# Altium project STM32_DSP.PrjPcb (part 1 of 2)
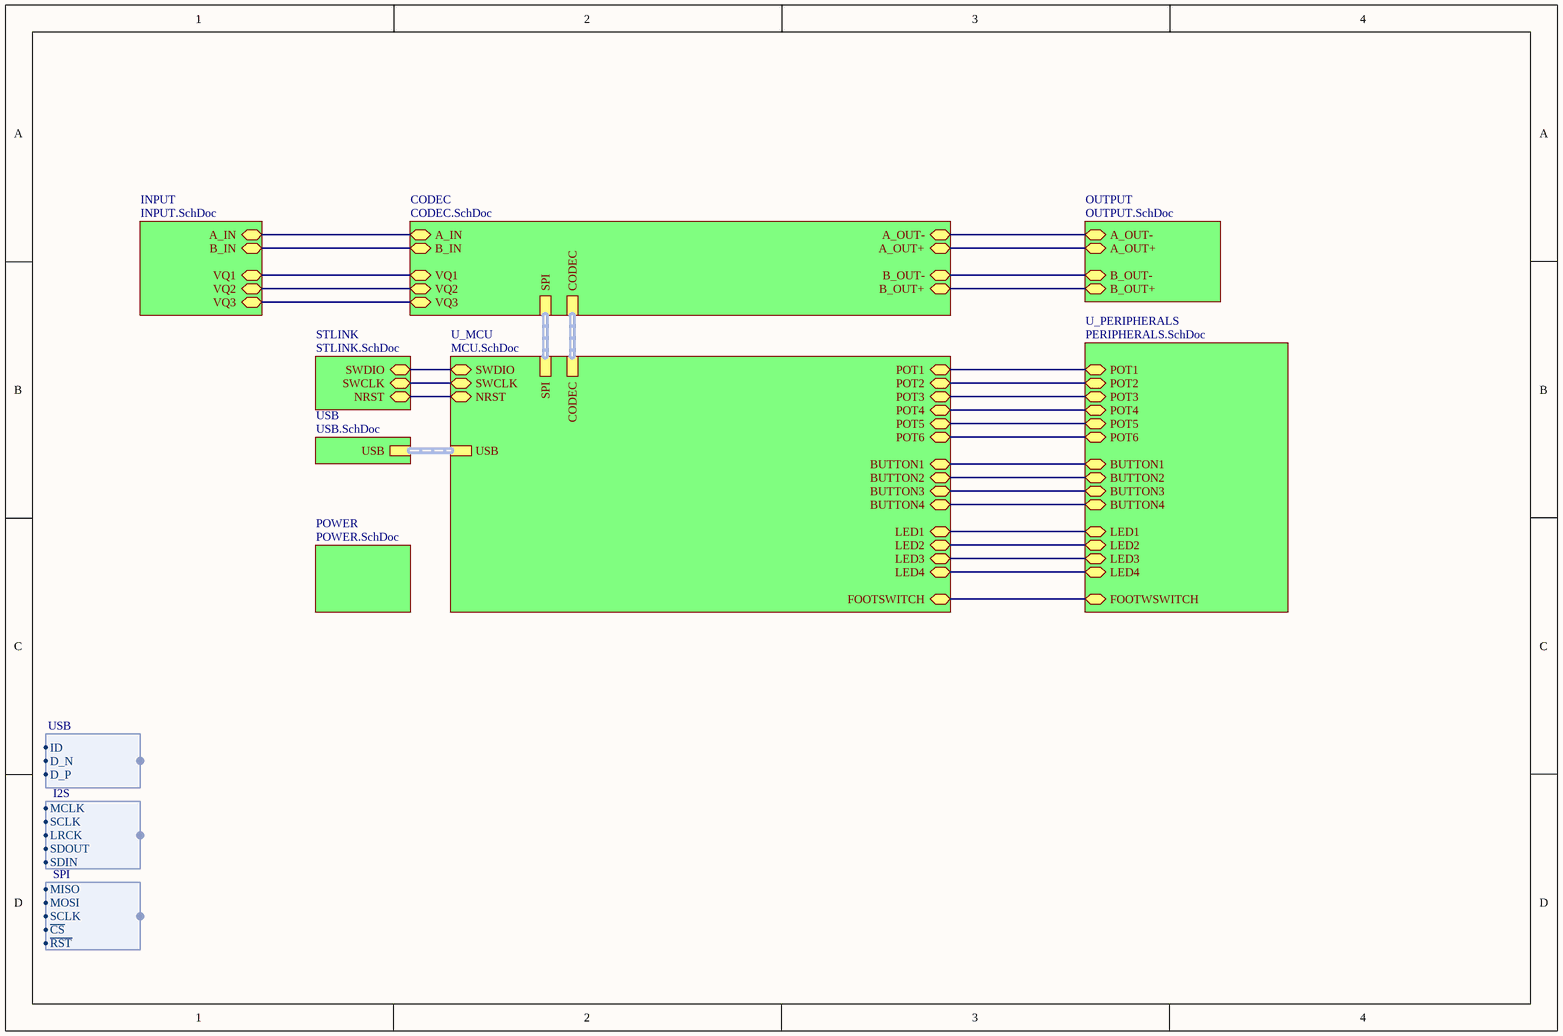
[diagram p0: TOP.SchDoc]
9 sheets, 281 parts. Net scope: hierarchical (ports join the sheet entries above them; power ports are global).
Board file: STM32_DSP.PcbDoc
Sheets:
  TOP.SchDoc
    INPUT = INPUT.SchDoc
    OUTPUT = OUTPUT.SchDoc
    CODEC = CODEC.SchDoc
    STLINK = STLINK.SchDoc
    U_MCU = MCU.SchDoc
    U_PERIPHERALS = PERIPHERALS.SchDoc
    USB = USB.SchDoc
    POWER = POWER.SchDoc

## Sheet TOP.SchDoc
size A4; SheetNumber: 1; SheetTotal: 9

### Sub-sheets
CODEC = CODEC.SchDoc: CODEC (harness I2S), A_OUT- (bidir), A_OUT+ (bidir), B_OUT- (bidir), B_OUT+ (bidir), SPI (harness SPI), A_IN (bidir), B_IN (bidir), VQ1 (bidir), VQ2 (bidir), VQ3 (bidir)
INPUT = INPUT.SchDoc: VQ2 (bidir), VQ1 (bidir), VQ3 (bidir), A_IN (bidir), B_IN (bidir)
OUTPUT = OUTPUT.SchDoc: A_OUT- (bidir), A_OUT+ (bidir), B_OUT- (bidir), B_OUT+ (bidir)
POWER = POWER.SchDoc: no entries
STLINK = STLINK.SchDoc: SWDIO (bidir), SWCLK (bidir), NRST (bidir)
U_MCU = MCU.SchDoc: NRST (bidir), SWDIO (bidir), SWCLK (bidir), CODEC (harness I2S), SPI (harness SPI), POT1 (bidir), POT2 (bidir), POT3 (bidir), POT4 (bidir), POT5 (bidir), POT6 (bidir), BUTTON1 (bidir), BUTTON2 (bidir), BUTTON3 (bidir), BUTTON4 (bidir), LED1 (bidir), LED2 (bidir), LED3 (bidir), LED4 (bidir), FOOTSWITCH (bidir), USB (harness USB)
U_PERIPHERALS = PERIPHERALS.SchDoc: POT4 (bidir), POT5 (bidir), POT6 (bidir), POT1 (bidir), POT2 (bidir), POT3 (bidir), LED3 (bidir), LED1 (bidir), LED4 (bidir), LED2 (bidir), BUTTON1 (bidir), BUTTON3 (bidir), BUTTON2 (bidir), BUTTON4 (bidir), FOOTWSWITCH (bidir)
USB = USB.SchDoc: USB (harness USB)

### Harnesses
USB: D_P, D_N, ID
I2S: MCLK, SCLK, LRCK, SDOUT, SDIN
SPI: MISO, MOSI, SCLK, ~{CS}, ~{RST}

### Nets
A_IN: sheet INPUT/A_IN, sheet CODEC/A_IN
A_OUT+: sheet OUTPUT/A_OUT+, sheet CODEC/A_OUT+
A_OUT-: sheet OUTPUT/A_OUT-, sheet CODEC/A_OUT-
B_IN: sheet INPUT/B_IN, sheet CODEC/B_IN
B_OUT+: sheet OUTPUT/B_OUT+, sheet CODEC/B_OUT+
B_OUT-: sheet OUTPUT/B_OUT-, sheet CODEC/B_OUT-
BUTTON1: sheet U_MCU/BUTTON1, sheet U_PERIPHERALS/BUTTON1
BUTTON2: sheet U_MCU/BUTTON2, sheet U_PERIPHERALS/BUTTON2
BUTTON3: sheet U_MCU/BUTTON3, sheet U_PERIPHERALS/BUTTON3
BUTTON4: sheet U_MCU/BUTTON4, sheet U_PERIPHERALS/BUTTON4
FOOTSWITCH: sheet U_MCU/FOOTSWITCH, sheet U_PERIPHERALS/FOOTWSWITCH
LED1: sheet U_MCU/LED1, sheet U_PERIPHERALS/LED1
LED2: sheet U_MCU/LED2, sheet U_PERIPHERALS/LED2
LED3: sheet U_MCU/LED3, sheet U_PERIPHERALS/LED3
LED4: sheet U_MCU/LED4, sheet U_PERIPHERALS/LED4
NRST: sheet STLINK/NRST, sheet U_MCU/NRST
POT1: sheet U_MCU/POT1, sheet U_PERIPHERALS/POT1
POT2: sheet U_MCU/POT2, sheet U_PERIPHERALS/POT2
POT3: sheet U_MCU/POT3, sheet U_PERIPHERALS/POT3
POT4: sheet U_MCU/POT4, sheet U_PERIPHERALS/POT4
POT5: sheet U_MCU/POT5, sheet U_PERIPHERALS/POT5
POT6: sheet U_MCU/POT6, sheet U_PERIPHERALS/POT6
SWCLK: sheet STLINK/SWCLK, sheet U_MCU/SWCLK
SWDIO: sheet STLINK/SWDIO, sheet U_MCU/SWDIO
VQ1: sheet INPUT/VQ1, sheet CODEC/VQ1
VQ2: sheet INPUT/VQ2, sheet INPUT/VQ3, sheet CODEC/VQ2, sheet CODEC/VQ3

### Buses and harness runs
harness sheet CODEC/CODEC = sheet U_MCU/CODEC
harness sheet CODEC/SPI = sheet U_MCU/SPI
harness sheet U_MCU/USB = sheet USB/USB

## Sheet INPUT.SchDoc
size A4; SheetNumber: 2; SheetTotal: 9
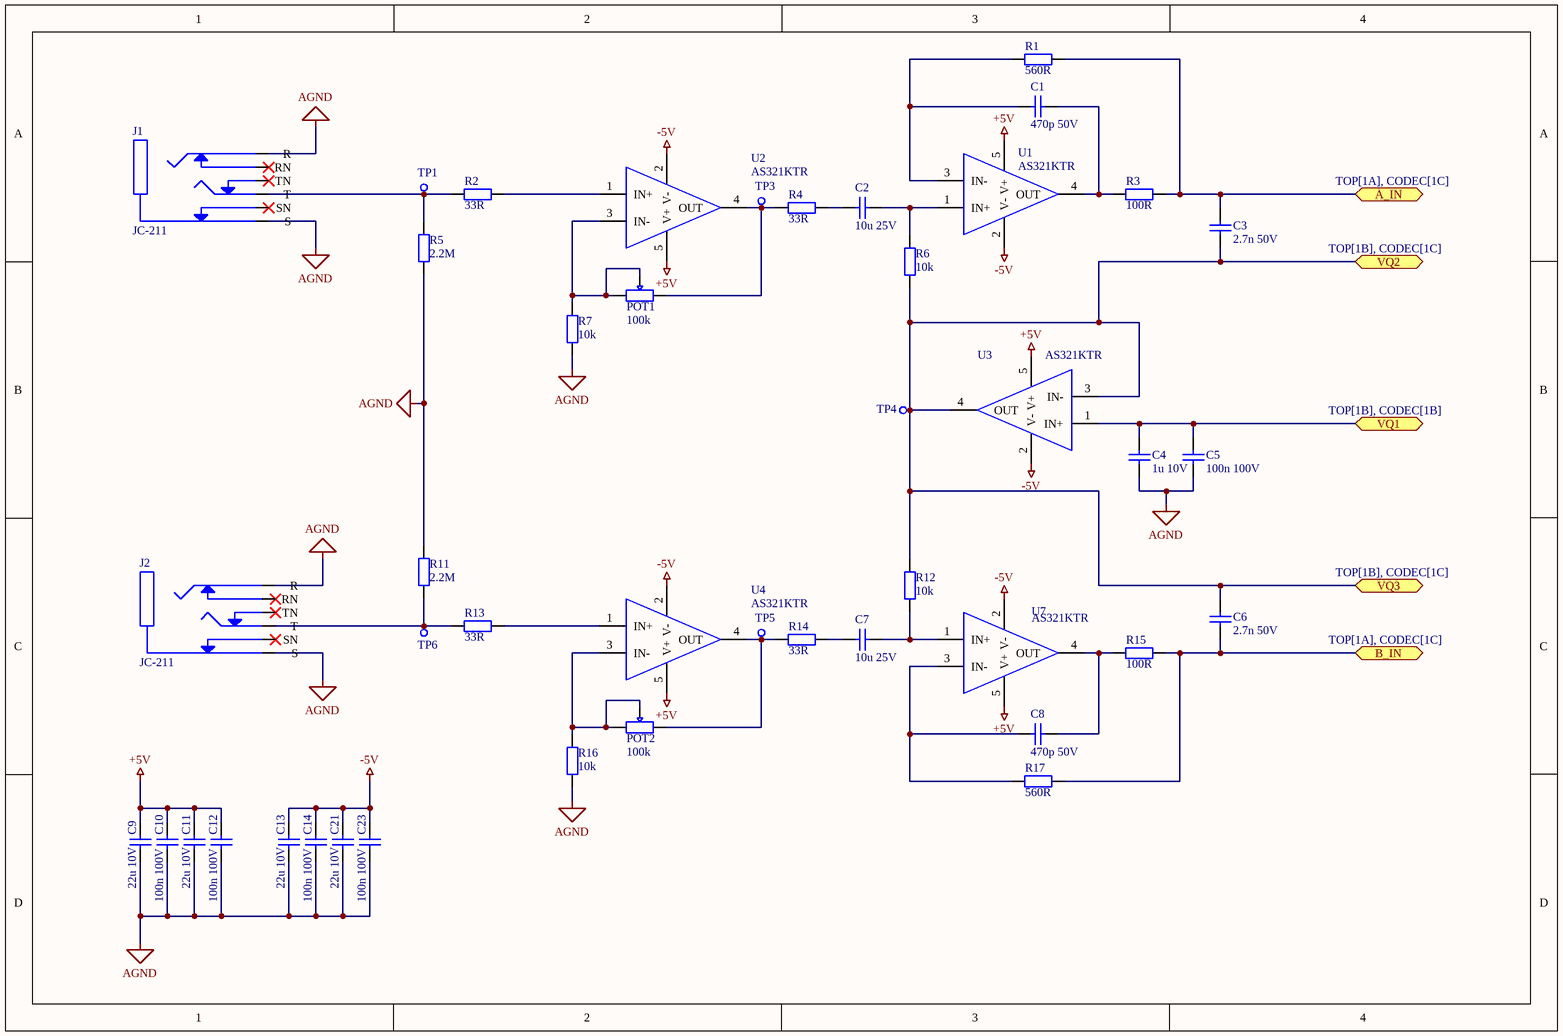
[diagram p1: INPUT.SchDoc]

### Parts
C1  470p 50V  [CAPACITOR 0805]
C2  10u 25V  [CAPACITOR 0805]
C3  2.7n 50V  [CAPACITOR 0805]
C4  1u 10V  [CAPACITOR 0805]
C5  100n 100V  [CAPACITOR 0805]
C6  2.7n 50V  [CAPACITOR 0805]
C7  10u 25V  [CAPACITOR 0805]
C8  470p 50V  [CAPACITOR 0805]
C9  22u 10V  [CAPACITOR 0805]
C10  100n 100V  [CAPACITOR 0805]
C11  22u 10V  [CAPACITOR 0805]
C12  100n 100V  [CAPACITOR 0805]
C13  22u 10V  [CAPACITOR 0805]
C14  100n 100V  [CAPACITOR 0805]
C21  22u 10V  [CAPACITOR 0805]
C23  100n 100V  [CAPACITOR 0805]
J1  JC-211  [AMPHENOL ACJM-MHDR]
J2  JC-211  [AMPHENOL ACJM-MHDR]
POT1  100k  [POTENTIOMETER 3362P]
POT2  100k  [POTENTIOMETER 3362P]
R1  560R  [RESISTOR 0805]
R2  33R  [RESISTOR 0805]
R3  100R  [RESISTOR 0805]
R4  33R  [RESISTOR 0805]
R5  2.2M  [RESISTOR 0805]
R6  10k  [RESISTOR 0805]
R7  10k  [RESISTOR 0805]
R11  2.2M  [RESISTOR 0805]
R12  10k  [RESISTOR 0805]
R13  33R  [RESISTOR 0805]
R14  33R  [RESISTOR 0805]
R15  100R  [RESISTOR 0805]
R16  10k  [RESISTOR 0805]
R17  560R  [RESISTOR 0805]
TP1  1mm  [TEST POINT 1MM]  (value not drawn)
TP3  1mm  [TEST POINT 1MM]  (value not drawn)
TP4  1mm  [TEST POINT 1MM]  (value not drawn)
TP5  1mm  [TEST POINT 1MM]  (value not drawn)
TP6  1mm  [TEST POINT 1MM]  (value not drawn)
U1  AS321KTR  [SOT23-5]
U2  AS321KTR  [SOT23-5]
U3  AS321KTR  [SOT23-5]
U4  AS321KTR  [SOT23-5]
U7  AS321KTR  [SOT23-5]

### Ports
A_IN (bidir, see TOP[1A], CODEC[1C]), B_IN (bidir, see TOP[1A], CODEC[1C]), VQ1 (bidir, see TOP[1B], CODEC[1B]), VQ2 (bidir, see TOP[1B], CODEC[1C]), VQ3 (bidir, see TOP[1B], CODEC[1C])

### Nets
+5V: C9.2 C10.2 C11.2 C12.2 U1.5(V+) U2.5(V+) U3.5(V+) U4.5(V+) U7.5(V+)
-5V: C13.2 C14.2 C21.2 C23.2 U1.2(V-) U2.2(V-) U3.2(V-) U4.2(V-) U7.2(V-)
AGND: C4.1 C5.1 C9.1 C10.1 C11.1 C12.1 C13.1 C14.1 C21.1 C23.1 J1.1(S) J1.2(R) J2.1(S) J2.2(R) R5.1 R7.1 R11.2 R16.1
A_IN: C3.2 R1.2 R3.2 ; port A_IN
B_IN: C6.2 R15.2 R17.2 ; port B_IN
VQ1: C4.2 C5.2 U3.1(IN+) ; port VQ1
VQ2: C3.1 C6.1 R6.1 R12.1 TP4.1 U3.3(IN-) U3.4(OUT) ; port VQ2, port VQ3
NetC1_1: C1.1 R1.1 U1.3(IN-)
NetC1_2: C1.2 R3.1 U1.4(OUT)
NetC2_1: C2.1 R4.2
NetC2_2: C2.2 R6.2 U1.1(IN+)
NetC7_1: C7.1 R14.2
NetC7_2: C7.2 R12.2 U7.1(IN+)
NetC8_1: C8.1 R17.1 U7.3(IN-)
NetC8_2: C8.2 R15.1 U7.4(OUT)
NetJ1_3: J1.3(T) R2.1 R5.2 TP1.1
NetJ2_3: J2.3(T) R11.1 R13.1 TP6.1
NetPOT1_1: POT1.1 POT1.2 R7.2 U2.3(IN-)
NetPOT1_3: POT1.3 R4.1 TP3.1 U2.4(OUT)
NetPOT2_1: POT2.1 POT2.2 R16.2 U4.3(IN-)
NetPOT2_3: POT2.3 R14.1 TP5.1 U4.4(OUT)
NetR2_2: R2.2 U2.1(IN+)
NetR13_2: R13.2 U4.1(IN+)

Not connected (* = marked no-connect by the designer): J1 4(TN)* 5(RN)* 6(SN)*; J2 4(TN)* 5(RN)* 6(SN)*

### Library data of the parts
C1 C8 = Capacitor 470p 50V 10% X7R 0805: Capacitor: ceramic; MLCC; 470pF; 50V; X7R; ±10%; SMD; 0805; Manufacturer: KEMET; Manufacturer Part Number: C0805C471K5RAC; ComponentLink1Description: Datasheet; ComponentLink1URL: https://www.tme.eu/Document/8b10290897269af8f8558c697aa8fd11/C0805C471K5RACTU.pdf; Footprint: Capacitor 0805; Price 10pcs [$]: 0.01970; Supplier: TME
C2 C7 = Capacitor 10u 25V 10% X5R 0805: Capacitor: ceramic; MLCC; 10uF; 25V; X5R; ±10%; SMD; 0805; Manufacturer: MURATA; Manufacturer Part Number: GRM21BR61E106KA73K; ComponentLink1Description: Datasheet; ComponentLink1URL: https://www.tme.eu/Document/58bb7db4269ac3ad53d1aa3c0ade9bab/GRM.pdf; Footprint: Capacitor 0805; Price 10pcs [$]: 0.0784; Supplier: TME
C3 C6 = Capacitor 2.7n 50V ±2% X7R 0805: Capacitor: ceramic; MLCC; 2.7nF; 50V; X7R; ±10%; SMD; 0805; Manufacturer: KYOCERA AVX; Manufacturer Part Number: 08055C272KAT2A; ComponentLink1Description: Datasheet; ComponentLink1URL: https://www.tme.eu/Document/78f46414e6dac38b7cca12338ea208b0/X7RDielectric.pdf; Price 10pcs [$]: 0.0680; Supplier: TME
C4 = Capacitor 1u 10V 10% X7R 0805: Capacitor: ceramic; MLCC; 1uF; 10V; X7R; ±10%; SMD; 0805; Manufacturer: YAGEO; Manufacturer Part Number: CC0805KKX7R6BB105; ComponentLink1Description: Datasheet; ComponentLink1URL: https://www.tme.eu/Document/fbb9415081fcefba62c0f8bbf5b21210/UPY-GPHC_X7R_6.3V-to-50V_20.pdf; Footprint: Capacitor 0805; Price 10pcs [$]: 0.0770; Supplier: TME
C5 C10 C12 C14 C23 = Capacitor 100n 100V 10% X7R 0805: Capacitor: ceramic; MLCC; 100nF; 100V; X7R; ±10%; SMD; 0805; Manufacturer: YAGEO; Manufacturer Part Number: CC0805KKX7R0BB104; ComponentLink1Description: Datasheet; ComponentLink1URL: https://www.tme.eu/Document/fbb9415081fcefba62c0f8bbf5b21210/UPY-GPHC_X7R_6.3V-to-50V_20.pdf; Footprint: Capacitor 0805; Price 10pcs [$]: 0.0770; Supplier: TME
C9 C11 C13 C21 = Capacitor 22u 10V 20% X5R 0805: Capacitor: ceramic; 22uF; 10V; X5R; ±20%; SMD; 0805; Manufacturer: SAMSUNG; Manufacturer Part Number: CL21A226MPQNNNE; ComponentLink1Description: Datasheet; ComponentLink1URL: https://www.tme.eu/Document/7da762c1dbaf553c64ad9c40d3603826/mlcc_samsung.pdf; Footprint: Capacitor 0805; Price 10pcs [$]: 0.0490; Supplier: TME
J1 J2 = Mechanical Jack 6.3mm Socket PCB THT JC-211: Socket; Jack 6,3mm; female; mono; ways: 2; for panel mounting; THT; Manufacturer: NINIGI; ComponentLink1Description: Datasheet; ComponentLink1URL: https://www.tme.eu/html/EN/connector-jack-6-3mm-socket/ramka_770_EN_pelny.html; Manufacturer Part Number: JC-211; Price 10pcs [$]: 0.581; Supplier: TME
POT1 POT2 = Potentiometer Trimmer 100k THT 3362P: Trimmer Resistors - Through Hole 1/4"SQ 100KOHMS 10% 0.5WATTS; Manufacturer: Bourns; Manufacturer Part Number: 3362P-1-104LF; ComponentLink1Description: Datasheet; ComponentLink1URL: https://www.mouser.pl/datasheet/2/54/3362-776956.pdf; Footprint: Potentiometer 3362P; Price 10pcs [$]: 0.909; Supplier: Mouser
R1 R17 = Resistor 560R 1% 1/8W 0805: Resistor: thick film; SMD; 0805; 560Ω; 0.125W; ±1%; -55÷155°C; Manufacturer: Yageo; Manufacturer Part Number: RC0805FR-07560R; ComponentLink1Description: Datasheet; ComponentLink1URL: https://www.tme.eu/Document/7b8fed8c112f8a94930279c22c957f7f/rc0805yageo.pdf; Footprint: Resistor 0805; Price 10pcs [$]: 0.023; Supplier: TME
R2 R4 R13 R14 = Resistor 33R 1% 1/8W 0805: Resistor: thick film; SMD; 0805; 33Ω; 0.125W; ±1%; -55÷155°C; Manufacturer: Yageo; Manufacturer Part Number: RC0805FR-0733R; ComponentLink1Description: Datasheet; ComponentLink1URL: https://www.tme.eu/Document/7b8fed8c112f8a94930279c22c957f7f/rc0805yageo.pdf; Footprint: Resistor 0805; Price 10pcs [$]: 0.023; Supplier: TME
R3 R15 = Resistor 100R 1% 1/8W 0805: Resistor: thick film; SMD; 0805; 100Ω; 0.125W; ±1%; -55÷155°C; Manufacturer: Yageo; Manufacturer Part Number: RC0805FR-07100R; ComponentLink1Description: Datasheet; ComponentLink1URL: https://www.tme.eu/Document/7b8fed8c112f8a94930279c22c957f7f/rc0805yageo.pdf; Footprint: Resistor 0805; Price 10pcs [$]: 0.023; Supplier: TME
R5 R11 = Resistor 2.2M 5% 1/8W 0805: Resistor: thick film; SMD; 0805; 2.2MΩ; 0.125W; ±5%; -55÷155°C; Manufacturer: Yageo; Manufacturer Part Number: RC0805JR-072M2; ComponentLink1Description: Datasheet; ComponentLink1URL: https://www.tme.eu/Document/7b8fed8c112f8a94930279c22c957f7f/rc0805yageo.pdf; Price 10pcs [$]: 0.016; Supplier: TME
R6 R7 R12 R16 = Resistor 10k 1% 1/8W 0805: Resistor: thick film; SMD; 0805; 10kΩ; 0.125W; ±1%; -55÷155°C; Manufacturer: Yageo; Manufacturer Part Number: RC0805FR-0710K; ComponentLink1Description: Datasheet; ComponentLink1URL: https://www.tme.eu/Document/7b8fed8c112f8a94930279c22c957f7f/rc0805yageo.pdf; Price 10pcs [$]: 0.016; Supplier: TME
TP1 TP3-TP6 = Mechanical Test Point 1mm: Tesp Point 1mm; ComponentLink1Description: Datasheet; ComponentLink1URL: -; Manufacturer: -; Manufacturer Part Number: -; Footprint: -; Price 10pcs [$]: -; Supplier: -
U1-U4 U7 = IC Op-Amp Single AS321KTR SOT23-5: IC: operational amplifier; 3÷36V; Ch: 1; SOT23-5; reel,tape; Manufacturer: DIODES INCORPORATED; Manufacturer Part Number: AS321KTR-G1; ComponentLink1Description: Datasheet; ComponentLink1URL: https://www.tme.eu/Document/ff04728045a484fb1c57ffb6d73e1bf1/AS321.pdf; Footprint: SOIC-8; Price 10pcs [$]: 0.214; Supplier: TME

## Sheet OUTPUT.SchDoc
size A4; SheetNumber: 3; SheetTotal: 9
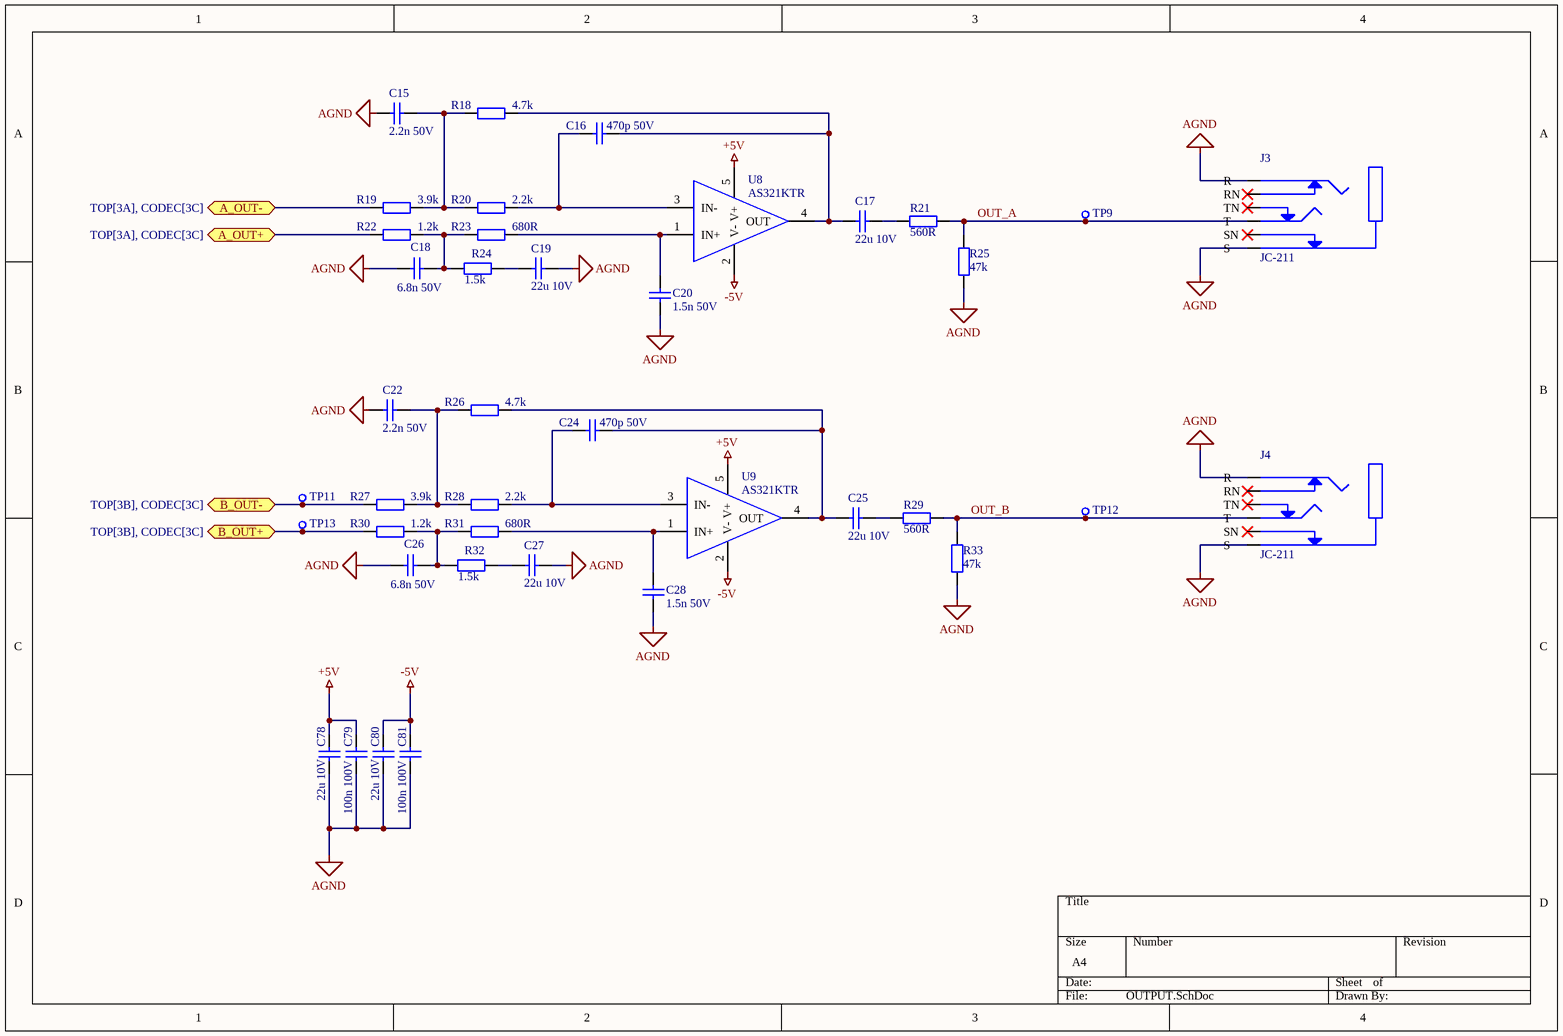
[diagram p2: OUTPUT.SchDoc]

### Parts
C15  2.2n 50V  [CAPACITOR 0805]
C16  470p 50V  [CAPACITOR 0805]
C17  22u 10V  [CAPACITOR 0805]
C18  6.8n 50V  [CAPACITOR 0805]
C19  22u 10V  [CAPACITOR 0805]
C20  1.5n 50V  [CAPACITOR 0805]
C22  2.2n 50V  [CAPACITOR 0805]
C24  470p 50V  [CAPACITOR 0805]
C25  22u 10V  [CAPACITOR 0805]
C26  6.8n 50V  [CAPACITOR 0805]
C27  22u 10V  [CAPACITOR 0805]
C28  1.5n 50V  [CAPACITOR 0805]
C78  22u 10V  [CAPACITOR 0805]
C79  100n 100V  [CAPACITOR 0805]
C80  22u 10V  [CAPACITOR 0805]
C81  100n 100V  [CAPACITOR 0805]
J3  JC-211  [AMPHENOL ACJM-MHDR]
J4  JC-211  [AMPHENOL ACJM-MHDR]
R18  4.7k  [RESISTOR 0805]
R19  3.9k  [RESISTOR 0805]
R20  2.2k  [RESISTOR 0805]
R21  560R  [RESISTOR 0805]
R22  1.2k  [RESISTOR 0805]
R23  680R  [RESISTOR 0805]
R24  1.5k  [RESISTOR 0805]
R25  47k  [RESISTOR 0805]
R26  4.7k  [RESISTOR 0805]
R27  3.9k  [RESISTOR 0805]
R28  2.2k  [RESISTOR 0805]
R29  560R  [RESISTOR 0805]
R30  1.2k  [RESISTOR 0805]
R31  680R  [RESISTOR 0805]
R32  1.5k  [RESISTOR 0805]
R33  47k  [RESISTOR 0805]
TP9  1mm  [TEST POINT 1MM]  (value not drawn)
TP11  1mm  [TEST POINT 1MM]  (value not drawn)
TP12  1mm  [TEST POINT 1MM]  (value not drawn)
TP13  1mm  [TEST POINT 1MM]  (value not drawn)
U8  AS321KTR  [SOT23-5]
U9  AS321KTR  [SOT23-5]

### Ports
A_OUT+ (bidir, see TOP[3A], CODEC[3C]), A_OUT- (bidir, see TOP[3A], CODEC[3C]), B_OUT+ (bidir, see TOP[3B], CODEC[3C]), B_OUT- (bidir, see TOP[3B], CODEC[3C])

### Nets
+5V: C78.2 C79.2 U8.5(V+) U9.5(V+)
-5V: C80.2 C81.2 U8.2(V-) U9.2(V-)
AGND: C15.1 C18.1 C19.2 C20.1 C22.1 C26.1 C27.2 C28.1 C78.1 C79.1 C80.1 C81.1 J3.1(S) J3.2(R) J4.1(S) J4.2(R) R25.1 R33.1
A_OUT+: R22.1 ; port A_OUT+
A_OUT-: R19.1 ; port A_OUT-
B_OUT+: R30.1 TP13.1 ; port B_OUT+
B_OUT-: R27.1 TP11.1 ; port B_OUT-
OUT_A: J3.3(T) R21.2 R25.2 TP9.1
OUT_B: J4.3(T) R29.2 R33.2 TP12.1
NetC15_2: C15.2 R18.1 R19.2 R20.1
NetC16_1: C16.1 R20.2 U8.3(IN-)
NetC16_2: C16.2 C17.1 R18.2 U8.4(OUT)
NetC17_2: C17.2 R21.1
NetC18_2: C18.2 R22.2 R23.1 R24.1
NetC19_1: C19.1 R24.2
NetC20_2: C20.2 R23.2 U8.1(IN+)
NetC22_2: C22.2 R26.1 R27.2 R28.1
NetC24_1: C24.1 R28.2 U9.3(IN-)
NetC24_2: C24.2 C25.1 R26.2 U9.4(OUT)
NetC25_2: C25.2 R29.1
NetC26_2: C26.2 R30.2 R31.1 R32.1
NetC27_1: C27.1 R32.2
NetC28_2: C28.2 R31.2 U9.1(IN+)

Not connected (* = marked no-connect by the designer): J3 4(TN)* 5(RN)* 6(SN)*; J4 4(TN)* 5(RN)* 6(SN)*

### Library data of the parts
C15 C22 = Capacitor 2.2n 50V ±2% X7R 0805: Capacitor: ceramic; MLCC; 2.2nF; 50V; X7R; ±10%; SMD; 0805; Manufacturer: KYOCERA AVX; Manufacturer Part Number: 08055C222KAT2A; ComponentLink1Description: Datasheet; ComponentLink1URL: https://www.tme.eu/Document/78f46414e6dac38b7cca12338ea208b0/X7RDielectric.pdf; Price 10pcs [$]: 0.0680; Supplier: TME
C16 C24 = Capacitor 470p 50V 10% X7R 0805: as C1 on sheet INPUT; ComponentLink1Description: Datasheet; ComponentLink1URL: https://www.tme.eu/Document/8b10290897269af8f8558c697aa8fd11/C0805C471K5RACTU.pdf; Footprint: Capacitor 0805; Price 10pcs [$]: 0.01970; Supplier: TME
C17 C19 C25 C27 C78 C80 = Capacitor 22u 10V 20% X5R 0805: as C9 on sheet INPUT; ComponentLink1Description: Datasheet; ComponentLink1URL: https://www.tme.eu/Document/7da762c1dbaf553c64ad9c40d3603826/mlcc_samsung.pdf; Footprint: Capacitor 0805; Price 10pcs [$]: 0.0490; Supplier: TME
C18 C26 = Capacitor 6.8n 50V ±2% X7R 0805: Capacitor: ceramic; MLCC; 6.8nF; 50V; X7R; ±10%; SMD; 0805; Manufacturer: KYOCERA AVX; Manufacturer Part Number: 08055C682KAT2A; ComponentLink1Description: Datasheet; ComponentLink1URL: https://www.tme.eu/Document/78f46414e6dac38b7cca12338ea208b0/X7RDielectric.pdf; Price 10pcs [$]: 0.0680; Supplier: TME
C20 C28 = Capacitor 1.5n 50V ±2% X7R 0805: Capacitor: ceramic; MLCC; 1.5nF; 50V; X7R; ±10%; SMD; 0805; Manufacturer: KYOCERA AVX; Manufacturer Part Number: 08055C152KAT2A; ComponentLink1Description: Datasheet; ComponentLink1URL: https://www.tme.eu/Document/78f46414e6dac38b7cca12338ea208b0/X7RDielectric.pdf; Price 10pcs [$]: 0.0680; Supplier: TME
C79 C81 = Capacitor 100n 100V 10% X7R 0805: as C5 on sheet INPUT; ComponentLink1Description: Datasheet; ComponentLink1URL: https://www.tme.eu/Document/fbb9415081fcefba62c0f8bbf5b21210/UPY-GPHC_X7R_6.3V-to-50V_20.pdf; Footprint: Capacitor 0805; Price 10pcs [$]: 0.0770; Supplier: TME
J3 J4 = Mechanical Jack 6.3mm Socket PCB THT JC-211: as J1 on sheet INPUT; ComponentLink1Description: Datasheet; ComponentLink1URL: https://www.tme.eu/html/EN/connector-jack-6-3mm-socket/ramka_770_EN_pelny.html; Manufacturer Part Number: JC-211; Price 10pcs [$]: 0.581; Supplier: TME
R18 R26 = Resistor 4.7k 1% 1/8W 0805: Resistor: thick film; SMD; 0805; 4.7kΩ; 0.125W; ±1%; -55÷155°C; Manufacturer: Yageo; Manufacturer Part Number: RC0805FR-074K7; ComponentLink1Description: Datasheet; ComponentLink1URL: https://www.tme.eu/Document/7b8fed8c112f8a94930279c22c957f7f/rc0805yageo.pdf; Price 10pcs [$]: 0.02250; Supplier: TME
R19 R27 = Resistor 3.9k 1% 1/8W 0805: Resistor: thick film; SMD; 0805; 3.9kkΩ; 0.125W; ±1%; -55÷155°C; Manufacturer: Yageo; Manufacturer Part Number: RC0805FR-073K9; ComponentLink1Description: Datasheet; ComponentLink1URL: https://www.tme.eu/Document/7b8fed8c112f8a94930279c22c957f7f/rc0805yageo.pdf; Price 10pcs [$]: 0.02250; Supplier: TME
R20 R28 = Resistor 2.2k 1% 1/8W 0805: Resistor: thick film; SMD; 0805; 2.2kΩ; 0.125W; ±1%; -55÷155°C; Manufacturer: Yageo; Manufacturer Part Number: RC0805FR-072K2; ComponentLink1Description: Datasheet; ComponentLink1URL: https://www.tme.eu/Document/7b8fed8c112f8a94930279c22c957f7f/rc0805yageo.pdf; Price 10pcs [$]: 0.02250; Supplier: TME
R21 R29 = Resistor 560R 1% 1/8W 0805: as R1 on sheet INPUT; ComponentLink1Description: Datasheet; ComponentLink1URL: https://www.tme.eu/Document/7b8fed8c112f8a94930279c22c957f7f/rc0805yageo.pdf; Footprint: Resistor 0805; Price 10pcs [$]: 0.023; Supplier: TME
R22 R30 = Resistor 1.2k 1% 1/8W 0805: Resistor: thick film; SMD; 0805; 1.2kΩ; 0.125W; ±1%; -55÷155°C; Manufacturer: Yageo; Manufacturer Part Number: RC0805FR-071K2; ComponentLink1Description: Datasheet; ComponentLink1URL: https://www.tme.eu/Document/7b8fed8c112f8a94930279c22c957f7f/rc0805yageo.pdf; Price 10pcs [$]: 0.02250; Supplier: TME
R23 R31 = Resistor 680R 1% 1/8W 0805: Resistor: thick film; SMD; 0805; 680Ω; 0.125W; ±1%; -55÷155°C; Manufacturer: Yageo; Manufacturer Part Number: RC0805FR-07680R; ComponentLink1Description: Datasheet; ComponentLink1URL: https://www.tme.eu/Document/7b8fed8c112f8a94930279c22c957f7f/rc0805yageo.pdf; Footprint: Resistor 0805; Price 10pcs [$]: 0.023; Supplier: TME
R24 R32 = Resistor 1.5k 1% 1/8W 0805: Resistor: thick film; SMD; 0805; 1.5kΩ; 0.125W; ±1%; -55÷155°C; Manufacturer: Yageo; Manufacturer Part Number: RC0805FR-071K5; ComponentLink1Description: Datasheet; ComponentLink1URL: https://www.tme.eu/Document/7b8fed8c112f8a94930279c22c957f7f/rc0805yageo.pdf; Price 10pcs [$]: 0.02250; Supplier: TME
R25 R33 = Resistor 47k 1% 1/8W 0805: Resistor: thick film; SMD; 0805; 47kΩ; 0.125W; ±1%; -55÷155°C; Manufacturer: Yageo; Manufacturer Part Number: RC0805FR-0747K; ComponentLink1Description: Datasheet; ComponentLink1URL: https://www.tme.eu/Document/7b8fed8c112f8a94930279c22c957f7f/rc0805yageo.pdf; Price 10pcs [$]: 0.04450; Supplier: TME
TP9 TP11-TP13 = Mechanical Test Point 1mm: Tesp Point 1mm; ComponentLink1Description: Datasheet; ComponentLink1URL: -; Manufacturer: -; Manufacturer Part Number: -; Footprint: -; Price 10pcs [$]: -; Supplier: -
U8 U9 = IC Op-Amp Single AS321KTR SOT23-5: as U1 on sheet INPUT; ComponentLink1Description: Datasheet; ComponentLink1URL: https://www.tme.eu/Document/ff04728045a484fb1c57ffb6d73e1bf1/AS321.pdf; Footprint: SOIC-8; Price 10pcs [$]: 0.214; Supplier: TME

## Sheet CODEC.SchDoc
size A4; SheetNumber: 4; SheetTotal: 9
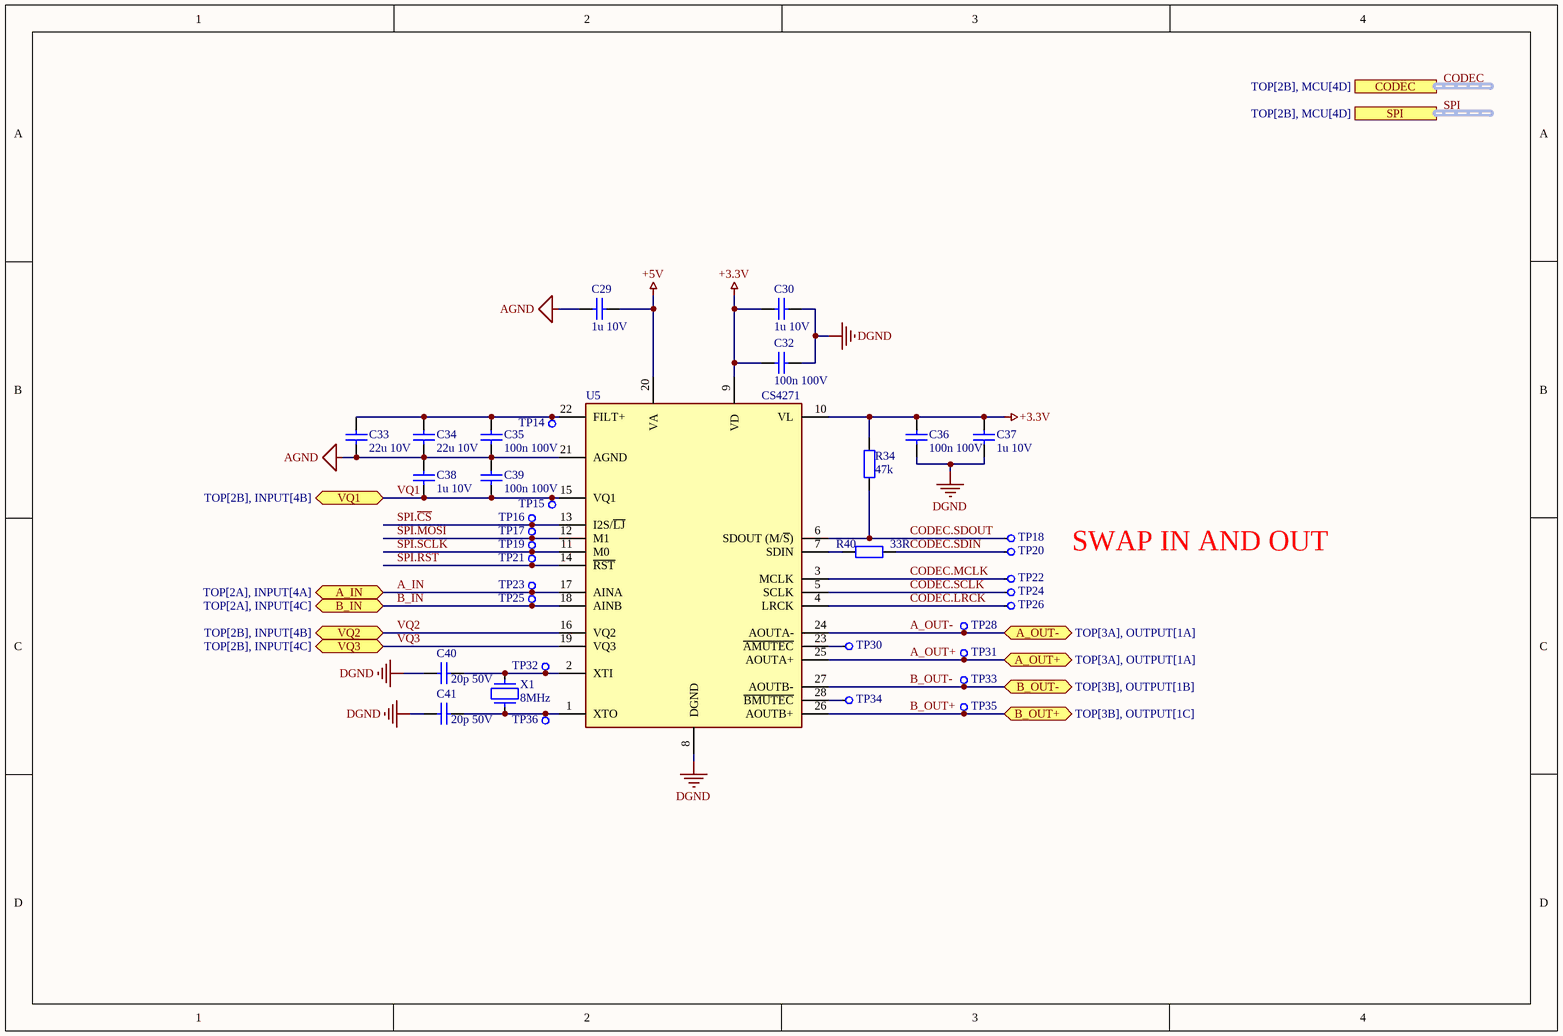
[diagram p3: CODEC.SchDoc]

### Parts
C29  1u 10V  [CAPACITOR 0805]
C30  1u 10V  [CAPACITOR 0805]
C32  100n 100V  [CAPACITOR 0805]
C33  22u 10V  [CAPACITOR 0805]
C34  22u 10V  [CAPACITOR 0805]
C35  100n 100V  [CAPACITOR 0805]
C36  100n 100V  [CAPACITOR 0805]
C37  1u 10V  [CAPACITOR 0805]
C38  1u 10V  [CAPACITOR 0805]
C39  100n 100V  [CAPACITOR 0805]
C40  20p 50V  [CAPACITOR 0805]
C41  20p 50V  [CAPACITOR 0805]
R34  47k  [RESISTOR 0805]
R40  33R  [RESISTOR 0805]
TP14  1mm  [TEST POINT 1MM]  (value not drawn)
TP15  1mm  [TEST POINT 1MM]  (value not drawn)
TP16  1mm  [TEST POINT 1MM]  (value not drawn)
TP17  1mm  [TEST POINT 1MM]  (value not drawn)
TP18  1mm  [TEST POINT 1MM]  (value not drawn)
TP19  1mm  [TEST POINT 1MM]  (value not drawn)
TP20  1mm  [TEST POINT 1MM]  (value not drawn)
TP21  1mm  [TEST POINT 1MM]  (value not drawn)
TP22  1mm  [TEST POINT 1MM]  (value not drawn)
TP23  1mm  [TEST POINT 1MM]  (value not drawn)
TP24  1mm  [TEST POINT 1MM]  (value not drawn)
TP25  1mm  [TEST POINT 1MM]  (value not drawn)
TP26  1mm  [TEST POINT 1MM]  (value not drawn)
TP28  1mm  [TEST POINT 1MM]  (value not drawn)
TP30  1mm  [TEST POINT 1MM]  (value not drawn)
TP31  1mm  [TEST POINT 1MM]  (value not drawn)
TP32  1mm  [TEST POINT 1MM]  (value not drawn)
TP33  1mm  [TEST POINT 1MM]  (value not drawn)
TP34  1mm  [TEST POINT 1MM]  (value not drawn)
TP35  1mm  [TEST POINT 1MM]  (value not drawn)
TP36  1mm  [TEST POINT 1MM]  (value not drawn)
U5  CS4271  [TSSOP-28]
X1  8MHz  [OSCILLATOR 8MHZ SMD]

### Ports
A_IN (bidir, see TOP[2A], INPUT[4A]), A_OUT+ (bidir, see TOP[3A], OUTPUT[1A]), A_OUT- (bidir, see TOP[3A], OUTPUT[1A]), B_IN (bidir, see TOP[2A], INPUT[4C]), B_OUT+ (bidir, see TOP[3B], OUTPUT[1C]), B_OUT- (bidir, see TOP[3B], OUTPUT[1B]), CODEC (harness I2S, see TOP[2B], MCU[4D]), SPI (harness spi, see TOP[2B], MCU[4D]), VQ1 (bidir, see TOP[2B], INPUT[4B]), VQ2 (bidir, see TOP[2B], INPUT[4B]), VQ3 (bidir, see TOP[2B], INPUT[4C])

### Nets
+3.3V: C30.1 C32.1 C36.2 C37.2 R34.2 U5.9(VD) U5.10(VL)
+5V: C29.1 U5.20(VA)
AGND: C29.2 C33.1 C34.1 C35.1 C38.2 C39.2 U5.21(AGND)
DGND: C30.2 C32.2 C36.1 C37.1 C40.2 C41.2 U5.8(DGND)
A_IN: TP23.1 U5.17(AINA) ; port A_IN
A_OUT+: TP31.1 U5.25(AOUTA+) ; port A_OUT+
A_OUT-: TP28.1 U5.24(AOUTA-) ; port A_OUT-
B_IN: TP25.1 U5.18(AINB) ; port B_IN
B_OUT+: TP35.1 U5.26(AOUTB+) ; port B_OUT+
B_OUT-: TP33.1 U5.27(AOUTB-) ; port B_OUT-
CODEC.LRCK: TP26.1 U5.4(LRCK)
CODEC.MCLK: TP22.1 U5.3(MCLK)
CODEC.SCLK: TP24.1 U5.5(SCLK)
CODEC.SDIN: R40.2 TP20.1
CODEC.SDOUT: R34.1 TP18.1 U5.6(SDOUT_(M/~{S}))
SPI.~{CS}: TP16.1 U5.13(I2S/~{LJ})
SPI.MOSI: TP17.1 U5.12(M1)
SPI.~{RST}: TP21.1 U5.14(~{RST})
SPI.SCLK: TP19.1 U5.11(M0)
VQ1: C38.1 C39.1 TP15.1 U5.15(VQ1) ; port VQ1
VQ2: U5.16(VQ2) U5.19(VQ3) ; port VQ2, port VQ3  [also labelled VQ3]
NetC33_2: C33.2 C34.2 C35.2 TP14.1 U5.22(FILT+)
NetC40_1: C40.1 TP32.1 U5.2(XTI) X1.2
NetC41_1: C41.1 TP36.1 U5.1(XTO) X1.1
NetR40_1: R40.1 U5.7(SDIN)
NetTP30_1: TP30.1 U5.23(~{AMUTEC})
NetTP34_1: TP34.1 U5.28(~{BMUTEC})

### Buses and harness runs
harness CODEC = port CODEC
harness SPI = port SPI

### Notes on the sheet
- SWAP IN AND OUT

### Library data of the parts
C29 C30 C37 C38 = Capacitor 1u 10V 10% X7R 0805: as C4 on sheet INPUT; ComponentLink1Description: Datasheet; ComponentLink1URL: https://www.tme.eu/Document/fbb9415081fcefba62c0f8bbf5b21210/UPY-GPHC_X7R_6.3V-to-50V_20.pdf; Footprint: Capacitor 0805; Price 10pcs [$]: 0.0770; Supplier: TME
C32 C35 C36 C39 = Capacitor 100n 100V 10% X7R 0805: as C5 on sheet INPUT; ComponentLink1Description: Datasheet; ComponentLink1URL: https://www.tme.eu/Document/fbb9415081fcefba62c0f8bbf5b21210/UPY-GPHC_X7R_6.3V-to-50V_20.pdf; Footprint: Capacitor 0805; Price 10pcs [$]: 0.0770; Supplier: TME
C33 C34 = Capacitor 22u 10V 20% X5R 0805: as C9 on sheet INPUT; ComponentLink1Description: Datasheet; ComponentLink1URL: https://www.tme.eu/Document/7da762c1dbaf553c64ad9c40d3603826/mlcc_samsung.pdf; Footprint: Capacitor 0805; Price 10pcs [$]: 0.0490; Supplier: TME
C40 C41 = Capacitor 20p 50V ±5% NP0 0805: Capacitor: ceramic; MLCC; 20pF; 50V; C0G (NP0); ±5%; SMD; 0805; Manufacturer: KYOCERA AVX; Manufacturer Part Number: 08055A200JAT2A; ComponentLink1Description: Datasheet; ComponentLink1URL: https://www.tme.eu/Document/bbf9b851c2f67970461c4f5edb477604/C0GNP0-Dielectric.pdf; Footprint: Capacitor 0805; Price 10pcs [$]: 0.0910; Supplier: TME
R34 = Resistor 47k 1% 1/8W 0805: as R25 on sheet OUTPUT; ComponentLink1Description: Datasheet; ComponentLink1URL: https://www.tme.eu/Document/7b8fed8c112f8a94930279c22c957f7f/rc0805yageo.pdf; Price 10pcs [$]: 0.04450; Supplier: TME
R40 = Resistor 33R 1% 1/8W 0805: as R2 on sheet INPUT; ComponentLink1Description: Datasheet; ComponentLink1URL: https://www.tme.eu/Document/7b8fed8c112f8a94930279c22c957f7f/rc0805yageo.pdf; Footprint: Resistor 0805; Price 10pcs [$]: 0.023; Supplier: TME
TP14-TP26 TP28 TP30-TP36 = Mechanical Test Point 1mm: Tesp Point 1mm; ComponentLink1Description: Datasheet; ComponentLink1URL: -; Manufacturer: -; Manufacturer Part Number: -; Footprint: -; Price 10pcs [$]: -; Supplier: -
U5 = IC Audio CODEC CS4271 TSSOP-28: Interface - CODECs Stereo Audio CODEC 108 dB 192 kHz; Manufacturer Part Number: CS4271-CZZ; Manufacturer: Cirrus Logic; Price 10pcs [$]: 15.38; Supplier: TME; ComponentLink1Description: Datasheet; ComponentLink1URL: https://www.tme.eu/Document/0e51b527b703e13d60b8191234a4da56/CS4271.pdf
X1 = Crystal 8MHz 20p SMD: Crystals CRYSTAL 8.0000MHZ 20PF SMD; Manufacturer: ABRACON; Manufacturer Part Number: ABLS-8.000MHZ-20-B-3-H-T; ComponentLink1Description: Datasheet; ComponentLink1URL: https://www.mouser.pl/datasheet/2/3/abls-1664338.pdf; Price 10pcs [$]: 0.129; Supplier: Mouser

## Sheet STLINK.SchDoc
size A4; SheetNumber: 6; SheetTotal: 9
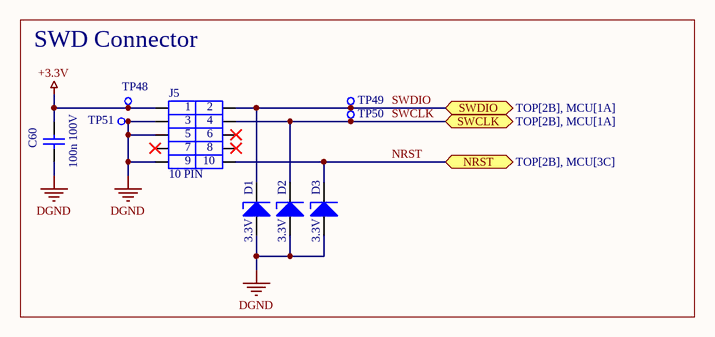
[diagram p4: STLINK.SchDoc]

### Parts
C60  100n 100V  [CAPACITOR 0805]
D1  3.3V  [DIODE SOD523F]
D2  3.3V  [DIODE SOD523F]
D3  3.3V  [DIODE SOD523F]
J5  10 PIN  [MECHANICAL PINHEADER 2x5P 1.27MM MALE]
TP48  1mm  [TEST POINT 1MM]  (value not drawn)
TP49  1mm  [TEST POINT 1MM]  (value not drawn)
TP50  1mm  [TEST POINT 1MM]  (value not drawn)
TP51  1mm  [TEST POINT 1MM]  (value not drawn)

### Blocks framed on the sheet
SWD Connector: C60 D1-D3 J5 TP48-TP51

### Ports
NRST (bidir, see TOP[2B], MCU[3C]), SWCLK (bidir, see TOP[2B], MCU[1A]), SWDIO (bidir, see TOP[2B], MCU[1A])

### Nets
+3.3V: C60.2 J5.1 TP48.1
DGND: C60.1 D1.1 D2.1 D3.1 J5.3 J5.5 J5.9 TP51.1
NRST: D3.2 J5.10 ; port NRST
SWCLK: D2.2 J5.4 TP50.1 ; port SWCLK
SWDIO: D1.2 J5.2 TP49.1 ; port SWDIO

Not connected (* = marked no-connect by the designer): J5 6* 7* 8*

### Library data of the parts
C60 = Capacitor 100n 100V 10% X7R 0805: as C5 on sheet INPUT; ComponentLink1Description: Datasheet; ComponentLink1URL: https://www.tme.eu/Document/fbb9415081fcefba62c0f8bbf5b21210/UPY-GPHC_X7R_6.3V-to-50V_20.pdf; Footprint: Capacitor 0805; Price 10pcs [$]: 0.0770; Supplier: TME
D1-D3 = Diode TVS 3.3V Unidirectional ESD5Z3V3: Diode: TVS; 134W; 5V; 11.2A; unidirectional; SOD523F; reel,tape; Manufacturer: DIOTEC SEMICONDUCTOR; Manufacturer Part Number: ESD5Z3V3; Price 10pcs [$]: 0.0484; Supplier: TME; ComponentLink1Description: Datasheet; ComponentLink1URL: https://www.tme.eu/Document/ce6dc2b16f15e75cb22a06d57779cb3c/esd5z2v5.pdf
J5 = Mechanical Pinheader Male 2x5pin P=1.27mm THT: Pin header; pin strips; male; PIN: 10; straight; 1.27mm; THT; 2x5; Manufacturer: CONNFLY; Manufacturer Part Number: DS1031-06-2*5P8BV41-3A; ComponentLink1Description: Datasheet; ComponentLink1URL: https://www.tme.eu/Document/a3f73054ce53c2beb96c95af7253a843/DS1031-06.pdf; Price 10pcs [$]: 0.430; Supplier: TME
TP48-TP51 = Mechanical Test Point 1mm: Tesp Point 1mm; ComponentLink1Description: Datasheet; ComponentLink1URL: -; Manufacturer: -; Manufacturer Part Number: -; Footprint: -; Price 10pcs [$]: -; Supplier: -

## Sheet MCU.SchDoc
size A4; SheetNumber: 5; SheetTotal: 9
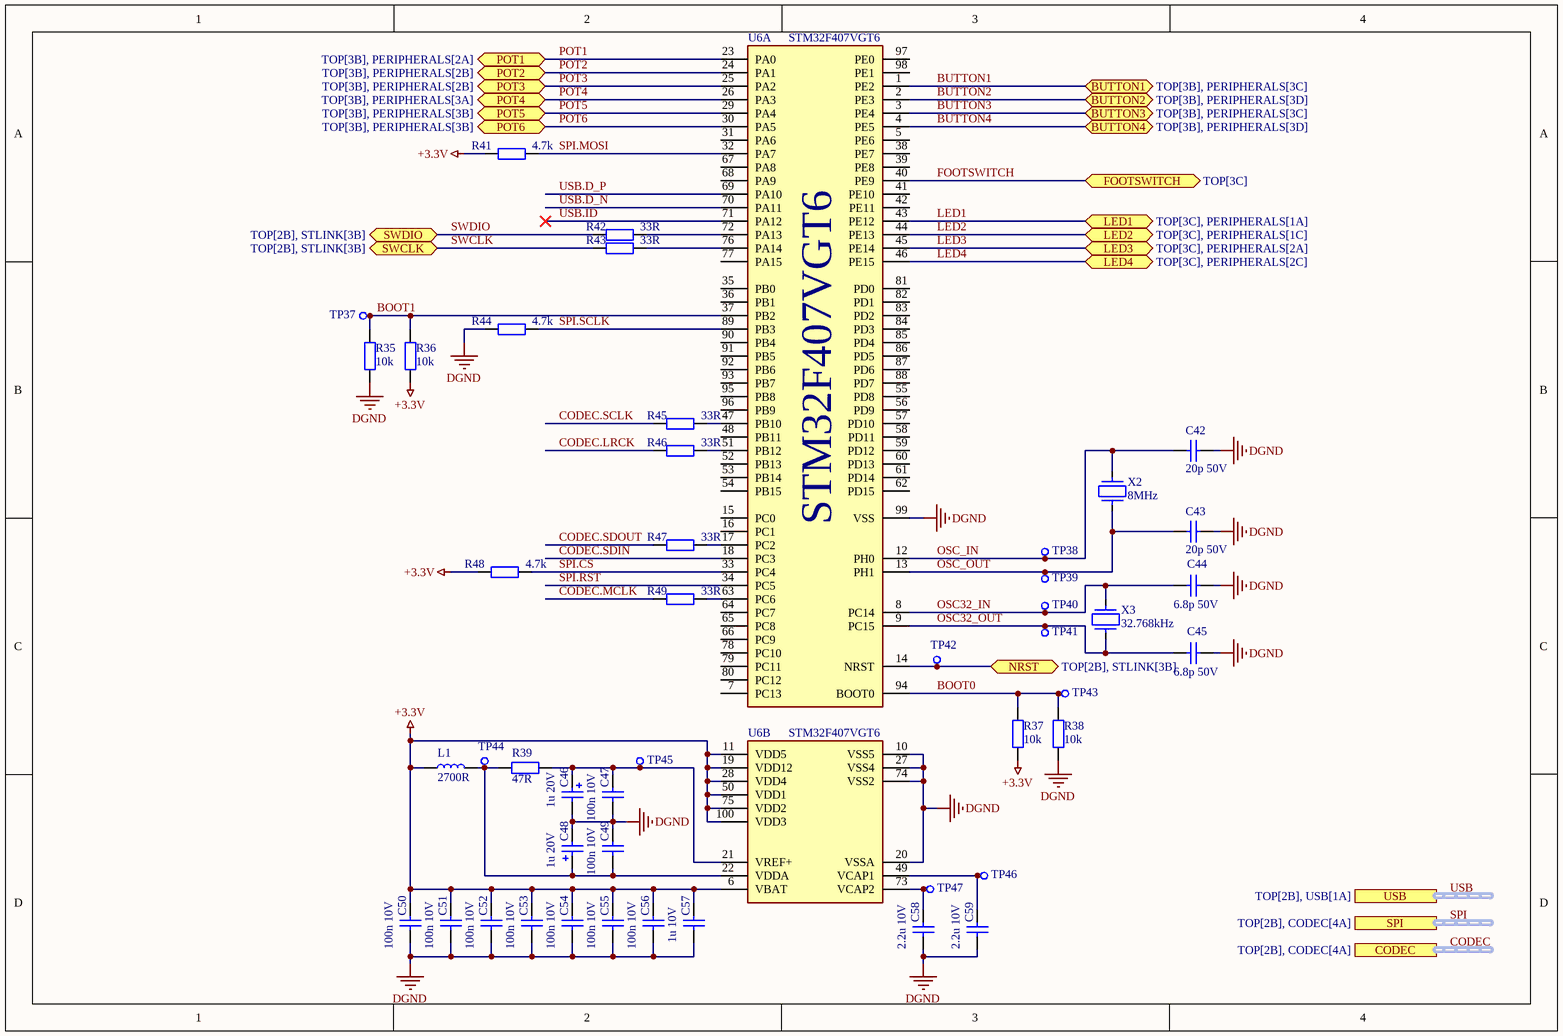
[diagram p5: MCU.SchDoc]

### Parts
C42  20p 50V  [CAPACITOR 0805]
C43  20p 50V  [CAPACITOR 0805]
C44  6.8p 50V  [CAPACITOR 0805]
C45  6.8p 50V  [CAPACITOR 0805]
C46  1u 20V  [CAPACITOR 1206]
C47  100n 10V  [CAPACITOR 0805]
C48  1u 20V  [CAPACITOR 1206]
C49  100n 10V  [CAPACITOR 0805]
C50  100n 10V  [CAPACITOR 0805]
C51  100n 10V  [CAPACITOR 0805]
C52  100n 10V  [CAPACITOR 0805]
C53  100n 10V  [CAPACITOR 0805]
C54  100n 10V  [CAPACITOR 0805]
C55  100n 10V  [CAPACITOR 0805]
C56  100n 10V  [CAPACITOR 0805]
C57  1u 10V  [CAPACITOR 0805]
C58  2.2u 10V  [CAPACITOR 0805]
C59  2.2u 10V  [CAPACITOR 0805]
L1  2700R  [FERRITE 0805]
R35  10k  [RESISTOR 0805]
R36  10k  [RESISTOR 0805]
R37  10k  [RESISTOR 0805]
R38  10k  [RESISTOR 0805]
R39  47R  [RESISTOR 0805]
R41  4.7k  [RESISTOR 0805]
R42  33R  [RESISTOR 0805]
R43  33R  [RESISTOR 0805]
R44  4.7k  [RESISTOR 0805]
R45  33R  [RESISTOR 0805]
R46  33R  [RESISTOR 0805]
R47  33R  [RESISTOR 0805]
R48  4.7k  [RESISTOR 0805]
R49  33R  [RESISTOR 0805]
TP37  1mm  [TEST POINT 1MM]  (value not drawn)
TP38  1mm  [TEST POINT 1MM]  (value not drawn)
TP39  1mm  [TEST POINT 1MM]  (value not drawn)
TP40  1mm  [TEST POINT 1MM]  (value not drawn)
TP41  1mm  [TEST POINT 1MM]  (value not drawn)
TP42  1mm  [TEST POINT 1MM]  (value not drawn)
TP43  1mm  [TEST POINT 1MM]  (value not drawn)
TP44  1mm  [TEST POINT 1MM]  (value not drawn)
TP45  1mm  [TEST POINT 1MM]  (value not drawn)
TP46  1mm  [TEST POINT 1MM]  (value not drawn)
TP47  1mm  [TEST POINT 1MM]  (value not drawn)
U6  STM32F407VGT6  [LQFP-100]  (parts A,B of 2)
X2  8MHz  [OSCILLATOR 8MHZ SMD]
X3  32.768kHz  [OSCILLATOR 32.768KHZ SMD]

### Ports
BUTTON1 (bidir, see TOP[3B], PERIPHERALS[3C]), BUTTON2 (bidir, see TOP[3B], PERIPHERALS[3D]), BUTTON3 (bidir, see TOP[3B], PERIPHERALS[3C]), BUTTON4 (bidir, see TOP[3B], PERIPHERALS[3D]), CODEC (harness I2S, see TOP[2B], CODEC[4A]), FOOTSWITCH (bidir, see TOP[3C]), LED1 (bidir, see TOP[3C], PERIPHERALS[1A]), LED2 (bidir, see TOP[3C], PERIPHERALS[1C]), LED3 (bidir, see TOP[3C], PERIPHERALS[2A]), LED4 (bidir, see TOP[3C], PERIPHERALS[2C]), NRST (bidir, see TOP[2B], STLINK[3B]), POT1 (bidir, see TOP[3B], PERIPHERALS[2A]), POT2 (bidir, see TOP[3B], PERIPHERALS[2B]), POT3 (bidir, see TOP[3B], PERIPHERALS[2B]), POT4 (bidir, see TOP[3B], PERIPHERALS[3A]), POT5 (bidir, see TOP[3B], PERIPHERALS[3B]), POT6 (bidir, see TOP[3B], PERIPHERALS[3B]), SPI (harness SPI, see TOP[2B], CODEC[4A]), SWCLK (bidir, see TOP[2B], STLINK[3B]), SWDIO (bidir, see TOP[2B], STLINK[3B]), USB (harness USB, see TOP[2B], USB[1A])

### Nets
+3.3V: C50.2 C51.2 C52.2 C53.2 C54.2 C55.2 C56.2 C57.2 L1.1 R36.1 R37.1 R41.1 R48.1 U6.6(VBAT) U6.11(VDD5) U6.19(VDD12) U6.28(VDD4) U6.50(VDD1) U6.75(VDD2) U6.100(VDD3)
DGND: C42.2 C43.2 C44.2 C45.2 C46.2 C47.1 C48.2 C49.2 C50.1 C51.1 C52.1 C53.1 C54.1 C55.1 C56.1 C57.1 C58.1 C59.1 R35.1 R38.1 R44.1 U6.10(VSS5) U6.20(VSSA) U6.27(VSS4) U6.74(VSS2) U6.99(VSS)
BOOT0: R37.2 R38.2 TP43.1 U6.94(BOOT0)
BOOT1: R35.2 R36.2 TP37.1 U6.37(PB2)
BUTTON1: U6.1(PE2) ; port BUTTON1
BUTTON2: U6.2(PE3) ; port BUTTON2
BUTTON3: U6.3(PE4) ; port BUTTON3
BUTTON4: U6.4(PE5) ; port BUTTON4
CODEC.LRCK: R46.1
CODEC.MCLK: R49.1
CODEC.SCLK: R45.1
CODEC.SDIN: U6.18(PC3)
CODEC.SDOUT: R47.1
FOOTSWITCH: U6.40(PE9) ; port FOOTSWITCH
LED1: U6.43(PE12) ; port LED1
LED2: U6.44(PE13) ; port LED2
LED3: U6.45(PE14) ; port LED3
LED4: U6.46(PE15) ; port LED4
NRST: TP42.1 U6.14(NRST) ; port NRST
OSC32_IN: C44.1 TP40.1 U6.8(PC14) X3.1
OSC32_OUT: C45.1 TP41.1 U6.9(PC15) X3.4
OSC_IN: C42.1 TP38.1 U6.12(PH0) X2.2
OSC_OUT: C43.1 TP39.1 U6.13(PH1) X2.1
POT1: U6.23(PA0) ; port POT1
POT2: U6.24(PA1) ; port POT2
POT3: U6.25(PA2) ; port POT3
POT4: U6.26(PA3) ; port POT4
POT5: U6.29(PA4) ; port POT5
POT6: U6.30(PA5) ; port POT6
SPI.~{CS}: R48.2 U6.33(PC4)
SPI.MOSI: R41.2 U6.32(PA7)
SPI.~{RST}: U6.34(PC5)
SPI.SCLK: R44.2 U6.89(PB3)
SWCLK: R43.1 ; port SWCLK
SWDIO: R42.1 ; port SWDIO
USB.D_N: U6.70(PA11)
USB.D_P: U6.69(PA10)
USB.ID: U6.71(PA12)
NetC46_1: C46.1 C47.2 R39.2 TP45.1 U6.21(VREF+)
NetC48_1: C48.1 C49.1 L1.2 R39.1 TP44.1 U6.22(VDDA)
NetC58_2: C58.2 TP47.1 U6.73(VCAP2)
NetC59_2: C59.2 TP46.1 U6.49(VCAP1)
NetR42_2: R42.2 U6.72(PA13)
NetR43_2: R43.2 U6.76(PA14)
NetR45_2: R45.2 U6.47(PB10)
NetR46_2: R46.2 U6.51(PB12)
NetR47_2: R47.2 U6.17(PC2)
NetR49_2: R49.2 U6.63(PC6)

Not connected (* = marked no-connect by the designer): U6 5(PE6) 7(PC13) 15(PC0) 16(PC1) 31(PA6) 35(PB0) 36(PB1) 38(PE7) 39(PE8) 41(PE10) 42(PE11) 48(PB11) 52(PB13) 53(PB14) 54(PB15) 55(PD8) 56(PD9) 57(PD10) 58(PD11) 59(PD12) 60(PD13) 61(PD14) 62(PD15) 64(PC7) 65(PC8) 66(PC9) 67(PA8) 68(PA9) 77(PA15) 78(PC10) 79(PC11) 80(PC12) 81(PD0) 82(PD1) 83(PD2) 84(PD3) 85(PD4) 86(PD5) 87(PD6) 88(PD7) 90(PB4) 91(PB5) 92(PB6) 93(PB7) 95(PB8) 96(PB9) 97(PE0) 98(PE1)

### Buses and harness runs
harness CODEC = port CODEC
harness SPI = port SPI
harness USB = port USB

### Library data of the parts
C42 C43 = Capacitor 20p 50V ±5% NP0 0805: as C40 on sheet CODEC; ComponentLink1Description: Datasheet; ComponentLink1URL: https://www.tme.eu/Document/bbf9b851c2f67970461c4f5edb477604/C0GNP0-Dielectric.pdf; Footprint: Capacitor 0805; Price 10pcs [$]: 0.0910; Supplier: TME
C44 C45 = Capacitor 6.8p 50V ±0.25pF NP0 0805: Capacitor: ceramic; MLCC; 6.8pF; 50V; C0G (NP0); ±0.25pF; SMD; 0805; Manufacturer: YAGEO; Manufacturer Part Number: CC0805CRNPO96R8; ComponentLink1Description: Datasheet; ComponentLink1URL: https://www.tme.eu/Document/04f8372e9ba78fa4699feb147e4488d1/UPY-GP_NP0_16V-to-50V_18.pdf; Footprint: Capacitor 0805; Price 10pcs [$]: 0.0314; Supplier: TME
C46 C48 = Capacitor 1u 20V 20% Tantalum 1206: Capacitor: tantalum; 1uF; 20VDC; SMD; A; 1206; ±10%; -55÷125°C; T491; Manufacturer: KEMET; Manufacturer Part Number: T491A105K020AT; ComponentLink1Description: Datasheet; ComponentLink1URL: https://www.tme.eu/Document/7d1742c16e813d90cbbda272068592d8/Datasheet-T491A105K020AT.pdf; Footprint: Capacitor 1206; Price 10pcs [$]: 0.2; Supplier: TME
C47 C49-C56 = Capacitor 100n 100V 10% X7R 0805: as C5 on sheet INPUT; ComponentLink1Description: Datasheet; ComponentLink1URL: https://www.tme.eu/Document/fbb9415081fcefba62c0f8bbf5b21210/UPY-GPHC_X7R_6.3V-to-50V_20.pdf; Footprint: Capacitor 0805; Price 10pcs [$]: 0.0770; Supplier: TME
C57 = Capacitor 1u 10V 10% X7R 0805: as C4 on sheet INPUT; ComponentLink1Description: Datasheet; ComponentLink1URL: https://www.tme.eu/Document/fbb9415081fcefba62c0f8bbf5b21210/UPY-GPHC_X7R_6.3V-to-50V_20.pdf; Footprint: Capacitor 0805; Price 10pcs [$]: 0.0770; Supplier: TME
C58 C59 = Capacitor 2.2u 10V 10% X7R 0805: Multilayer Ceramic Capacitors MLCC - SMD/SMT 0603 16VDC 1uF 10% X7R; Manufacturer: YAGEO; Manufacturer Part Number: CC0805KKX7R6BB225; ComponentLink1Description: Datasheet; ComponentLink1URL: https://www.tme.eu/Document/fbb9415081fcefba62c0f8bbf5b21210/UPY-GPHC_X7R_6.3V-to-50V_20.pdf; Footprint: Capacitor 0805; Price 10pcs [$]: 0.0770; Supplier: TME
L1 = Inductor Ferrite Bead 2700Ω 0805 0.2A: Ferrite: bead; 2700Ω; SMD; 200mA; 0805; -55÷125°C; Manufacturer: MURATA; Manufacturer Part Number: BLM21BD272SN1L; ComponentLink1Description: Datasheet; ComponentLink1URL: https://www.tme.eu/Document/c9c44cce174b2958868ee1fe8b54450c/BLM21B222SPT-DTE.pdf; Price 10pcs [$]: 0.11; Supplier: TME
R35-R38 = Resistor 10k 1% 1/8W 0805: as R6 on sheet INPUT; ComponentLink1Description: Datasheet; ComponentLink1URL: https://www.tme.eu/Document/7b8fed8c112f8a94930279c22c957f7f/rc0805yageo.pdf; Price 10pcs [$]: 0.016; Supplier: TME
R39 = Resistor 47R 1% 1/8W 0805: Resistor: thick film; SMD; 0805; 47Ω; 0.125W; ±1%; -55÷155°C; Manufacturer: Yageo; Manufacturer Part Number: RC0805FR-0747R; ComponentLink1Description: Datasheet; ComponentLink1URL: https://www.tme.eu/Document/7b8fed8c112f8a94930279c22c957f7f/rc0805yageo.pdf; Footprint: Resistor 0805; Price 10pcs [$]: 0.023; Supplier: TME
R41 R44 R48 = Resistor 4.7k 1% 1/8W 0805: as R18 on sheet OUTPUT; ComponentLink1Description: Datasheet; ComponentLink1URL: https://www.tme.eu/Document/7b8fed8c112f8a94930279c22c957f7f/rc0805yageo.pdf; Price 10pcs [$]: 0.02250; Supplier: TME
R42 R43 R45-R47 R49 = Resistor 33R 1% 1/8W 0805: as R2 on sheet INPUT; ComponentLink1Description: Datasheet; ComponentLink1URL: https://www.tme.eu/Document/7b8fed8c112f8a94930279c22c957f7f/rc0805yageo.pdf; Footprint: Resistor 0805; Price 10pcs [$]: 0.023; Supplier: TME
TP37-TP47 = Mechanical Test Point 1mm: Tesp Point 1mm; ComponentLink1Description: Datasheet; ComponentLink1URL: -; Manufacturer: -; Manufacturer Part Number: -; Footprint: -; Price 10pcs [$]: -; Supplier: -
U6 = IC MCU ARM M4 STM32F407VGT6: IC: ARM microcontroller; 168MHz; LQFP100; 1.8÷3.6VDC; Manufacturer: STMicroelectronics; ComponentLink1Description: Datasheet; ComponentLink1URL: https://www.tme.eu/Document/fe050b8f135d502e6bbd22755be2aa50/stm32f405XX_F407XX.pdf; Manufacturer Part Number: STM32F407VGT6; Price 10pcs [$]: 15.02; Supplier: TME
X2 = Crystal 8MHz 20p SMD: as X1 on sheet CODEC; ComponentLink1Description: Datasheet; ComponentLink1URL: https://www.mouser.pl/datasheet/2/3/abls-1664338.pdf; Price 10pcs [$]: 0.129; Supplier: Mouser
X3 = Crystal 32.768kHz 8x3.2x2.38mm SMD: Resonator: watch; 32.768kHz; ±20ppm; SMD; 8x3.2x2.38mm; Manufacturer: EPSON; Manufacturer Part Number: MC306 32.768000KHZ 12.5PF; ComponentLink1Description: Datasheet; ComponentLink1URL: https://www.tme.eu/Document/8408670dbfdc08cb99f8b22d7675923e/MC-306_en.pdf; Price 10pcs [$]: 0.768; Supplier: TME

## Sheet PERIPHERALS.SchDoc
size A4; SheetNumber: 7; SheetTotal: 9
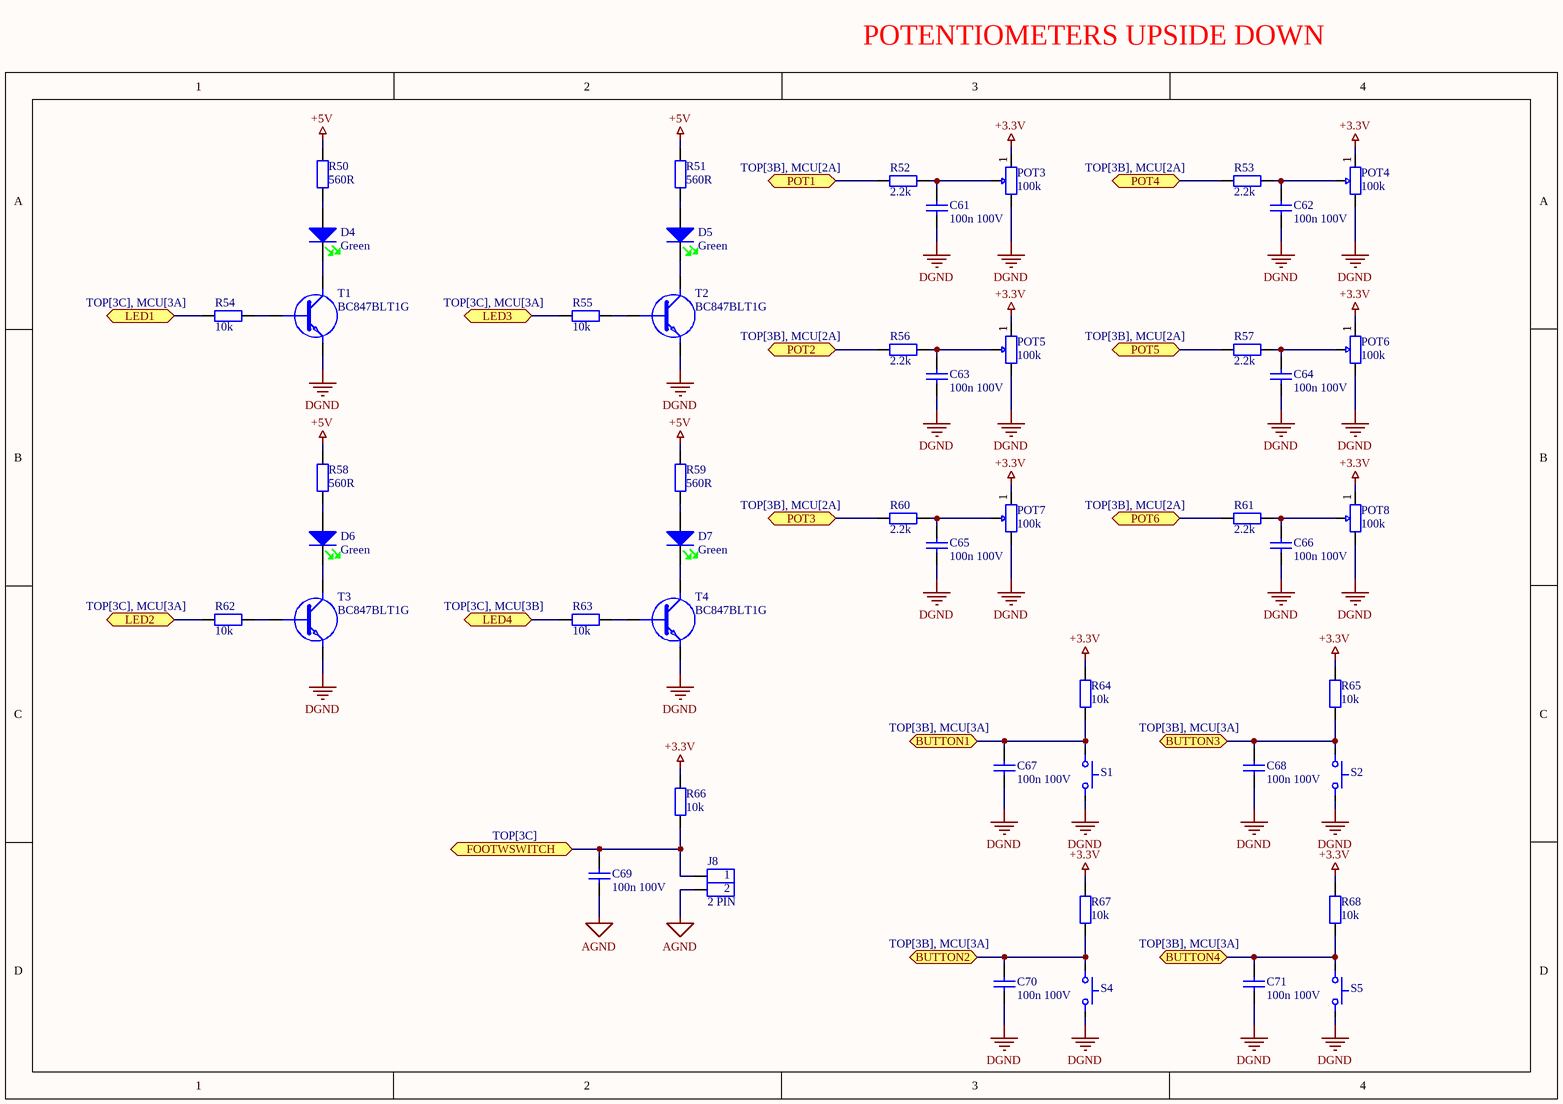
[diagram p6: PERIPHERALS.SchDoc]

### Parts
C61  100n 100V  [CAPACITOR 0805]
C62  100n 100V  [CAPACITOR 0805]
C63  100n 100V  [CAPACITOR 0805]
C64  100n 100V  [CAPACITOR 0805]
C65  100n 100V  [CAPACITOR 0805]
C66  100n 100V  [CAPACITOR 0805]
C67  100n 100V  [CAPACITOR 0805]
C68  100n 100V  [CAPACITOR 0805]
C69  100n 100V  [CAPACITOR 0805]
C70  100n 100V  [CAPACITOR 0805]
C71  100n 100V  [CAPACITOR 0805]
D4  Green  [LED 3MM GREEN]
D5  Green  [LED 3MM GREEN]
D6  Green  [LED 3MM GREEN]
D7  Green  [LED 3MM GREEN]
J8  2 PIN  [MECHANICAL PINHEADER 2P 2.54MM MALE]
POT3  100k  [POTENTIOMETER PTV09A W\H]
POT4  100k  [POTENTIOMETER PTV09A W\H]
POT5  100k  [POTENTIOMETER PTV09A W\H]
POT6  100k  [POTENTIOMETER PTV09A W\H]
POT7  100k  [POTENTIOMETER PTV09A W\H]
POT8  100k  [POTENTIOMETER PTV09A W\H]
R50  560R  [RESISTOR 0805]
R51  560R  [RESISTOR 0805]
R52  2.2k  [RESISTOR 0805]
R53  2.2k  [RESISTOR 0805]
R54  10k  [RESISTOR 0805]
R55  10k  [RESISTOR 0805]
R56  2.2k  [RESISTOR 0805]
R57  2.2k  [RESISTOR 0805]
R58  560R  [RESISTOR 0805]
R59  560R  [RESISTOR 0805]
R60  2.2k  [RESISTOR 0805]
R61  2.2k  [RESISTOR 0805]
R62  10k  [RESISTOR 0805]
R63  10k  [RESISTOR 0805]
R64  10k  [RESISTOR 0805]
R65  10k  [RESISTOR 0805]
R66  10k  [RESISTOR 0805]
R67  10k  [RESISTOR 0805]
R68  10k  [RESISTOR 0805]
S1  6x6mm  [MECHANICAL TACTSWITCH SMD 6x6]  (value not drawn)
S2  6x6mm  [MECHANICAL TACTSWITCH SMD 6x6]  (value not drawn)
S4  6x6mm  [MECHANICAL TACTSWITCH SMD 6x6]  (value not drawn)
S5  6x6mm  [MECHANICAL TACTSWITCH SMD 6x6]  (value not drawn)
T1  BC847BLT1G  [SOT23-3]
T2  BC847BLT1G  [SOT23-3]
T3  BC847BLT1G  [SOT23-3]
T4  BC847BLT1G  [SOT23-3]

### Ports
BUTTON1 (bidir, see TOP[3B], MCU[3A]), BUTTON2 (bidir, see TOP[3B], MCU[3A]), BUTTON3 (bidir, see TOP[3B], MCU[3A]), BUTTON4 (bidir, see TOP[3B], MCU[3A]), FOOTWSWITCH (bidir, see TOP[3C]), LED1 (bidir, see TOP[3C], MCU[3A]), LED2 (bidir, see TOP[3C], MCU[3A]), LED3 (bidir, see TOP[3C], MCU[3A]), LED4 (bidir, see TOP[3C], MCU[3B]), POT1 (bidir, see TOP[3B], MCU[2A]), POT2 (bidir, see TOP[3B], MCU[2A]), POT3 (bidir, see TOP[3B], MCU[2A]), POT4 (bidir, see TOP[3B], MCU[2A]), POT5 (bidir, see TOP[3B], MCU[2A]), POT6 (bidir, see TOP[3B], MCU[2A])

### Nets
+3.3V: POT3.1 POT4.1 POT5.1 POT6.1 POT7.1 POT8.1 R64.2 R65.2 R66.2 R67.2 R68.2
+5V: R50.2 R51.2 R58.2 R59.2
AGND: C69.1 J8.2
DGND: C61.1 C62.1 C63.1 C64.1 C65.1 C66.1 C67.1 C68.1 C70.1 C71.1 POT3.3 POT4.3 POT5.3 POT6.3 POT7.3 POT8.3 S1.2 S2.2 S4.2 S5.2 T1.2(E) T2.2(E) T3.2(E) T4.2(E)
BUTTON1: C67.2 R64.1 S1.1 ; port BUTTON1
BUTTON2: C70.2 R67.1 S4.1 ; port BUTTON2
BUTTON3: C68.2 R65.1 S2.1 ; port BUTTON3
BUTTON4: C71.2 R68.1 S5.1 ; port BUTTON4
FOOTSWITCH: C69.2 J8.1 R66.1 ; port FOOTWSWITCH
LED1: R54.1 ; port LED1
LED2: R62.1 ; port LED2
LED3: R55.1 ; port LED3
LED4: R63.1 ; port LED4
POT1: R52.1 ; port POT1
POT2: R56.1 ; port POT2
POT3: R60.1 ; port POT3
POT4: R53.1 ; port POT4
POT5: R57.1 ; port POT5
POT6: R61.1 ; port POT6
NetC61_2: C61.2 POT3.2 R52.2
NetC62_2: C62.2 POT4.2 R53.2
NetC63_2: C63.2 POT5.2 R56.2
NetC64_2: C64.2 POT6.2 R57.2
NetC65_2: C65.2 POT7.2 R60.2
NetC66_2: C66.2 POT8.2 R61.2
NetD4_1: D4.1 R50.1
NetD4_2: D4.2 T1.3(C)
NetD5_1: D5.1 R51.1
NetD5_2: D5.2 T2.3(C)
NetD6_1: D6.1 R58.1
NetD6_2: D6.2 T3.3(C)
NetD7_1: D7.1 R59.1
NetD7_2: D7.2 T4.3(C)
NetR54_2: R54.2 T1.1(B)
NetR55_2: R55.2 T2.1(B)
NetR62_2: R62.2 T3.1(B)
NetR63_2: R63.2 T4.1(B)

### Notes on the sheet
- POTENTIOMETERS UPSIDE DOWN

### Library data of the parts
C61-C71 = Capacitor 100n 100V 10% X7R 0805: as C5 on sheet INPUT; ComponentLink1Description: Datasheet; ComponentLink1URL: https://www.tme.eu/Document/fbb9415081fcefba62c0f8bbf5b21210/UPY-GPHC_X7R_6.3V-to-50V_20.pdf; Footprint: Capacitor 0805; Price 10pcs [$]: 0.0770; Supplier: TME
D4-D7 = Diode LED Green 3mm THT SMD 20mA: Manufacturer: -; Manufacturer Part Number: -; Footprint: -; Price 10pcs [$]: -; Supplier: -; ComponentLink1Description: Datasheet; ComponentLink1URL: -
J8 = Mechanical Pinheader Male 2pin P=2.54mm THT: Headers & Wire Housings 2.54MM CGRIDIII HDR 2P VERT SR SEL AU; Manufacturer: Molex; Manufacturer Part Number: 90120-0762; ComponentLink1Description: Datasheet; ComponentLink1URL: https://www.mouser.pl/datasheet/2/276/3/0901200765_PCB_HEADERS-2849265.pdf; Price 10pcs [$]: 0.593; Supplier: Mouser
POT3-POT8 = Potentiometer PCB 100k THT Linear PTV09A: Potentiometers 100K 20% 9MM CARBON POT; Manufacturer: Bourns; Manufacturer Part Number: PTV09A-4020U-B104; ComponentLink1Description: Datasheet; ComponentLink1URL: https://www.mouser.pl/datasheet/2/54/ptv09-777818.pdf; Footprint: Potentiometer PTV09A; Price 10pcs [$]: 0.749; Supplier: Mouser
R50 R51 R58 R59 = Resistor 560R 1% 1/8W 0805: as R1 on sheet INPUT; ComponentLink1Description: Datasheet; ComponentLink1URL: https://www.tme.eu/Document/7b8fed8c112f8a94930279c22c957f7f/rc0805yageo.pdf; Footprint: Resistor 0805; Price 10pcs [$]: 0.023; Supplier: TME
R52 R53 R56 R57 R60 R61 = Resistor 2.2k 1% 1/8W 0805: as R20 on sheet OUTPUT; ComponentLink1Description: Datasheet; ComponentLink1URL: https://www.tme.eu/Document/7b8fed8c112f8a94930279c22c957f7f/rc0805yageo.pdf; Price 10pcs [$]: 0.02250; Supplier: TME
R54 R55 R62-R68 = Resistor 10k 1% 1/8W 0805: as R6 on sheet INPUT; ComponentLink1Description: Datasheet; ComponentLink1URL: https://www.tme.eu/Document/7b8fed8c112f8a94930279c22c957f7f/rc0805yageo.pdf; Price 10pcs [$]: 0.016; Supplier: TME
S1 S2 S4 S5 = Mechanical Tact Switch 6x6mm THT: Tactile Switches 6 x 6 mm, 5 mm Act Height, 260 gf, Black, Short Crimped, Through Hole, SPST; Manufacturer: CUI Devices; Manufacturer Part Number: TS02-66-50-BK-260-SCR-D; ComponentLink1Description: Datasheet; ComponentLink1URL: https://www.mouser.pl/datasheet/2/670/ts02-2586188.pdf; Price 10pcs [$]: 0.097; Supplier: Mouser
T1-T4 = Transistor NPN 100mA 50V BC847BLT1G: Bipolar Transistors - BJT 100mA 50V NPN; Manufacturer: onsemi; Manufacturer Part Number: BC847BLT1G; Supplier: Mouser; Price 10pcs [$]: 0.094; ComponentLink1Description: Datasheet; ComponentLink1URL: https://www.mouser.pl/datasheet/2/308/BC846ALT1_D-1387679.pdf

## Sheet USB.SchDoc
size A4; SheetNumber: 8; SheetTotal: 9
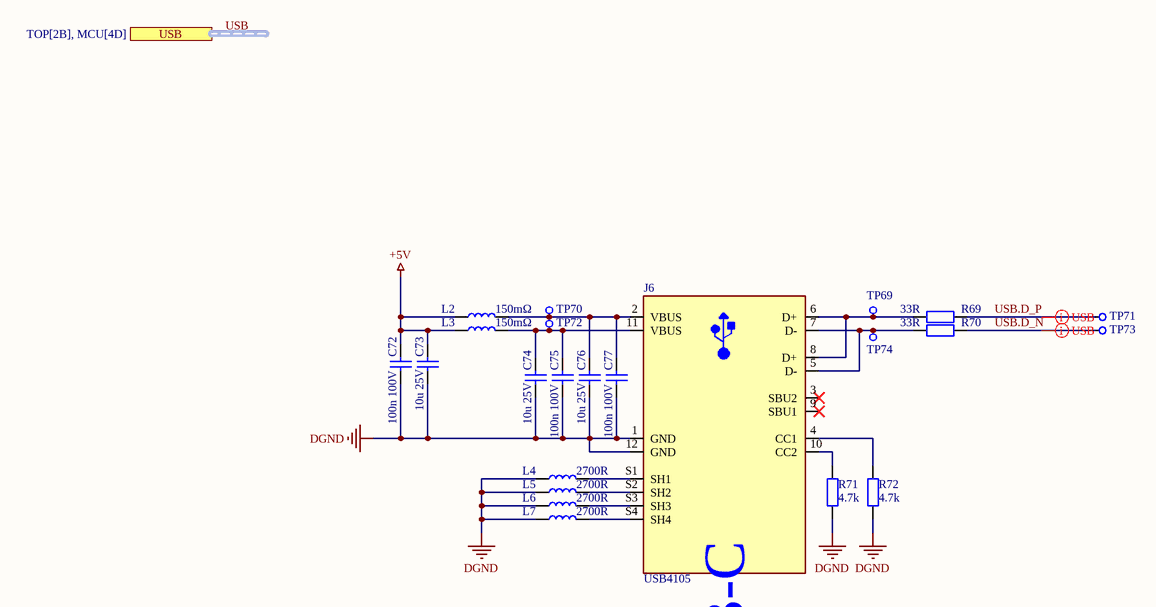
[diagram p7: USB.SchDoc]

### Parts
C72  100n 100V  [CAPACITOR 0805]
C73  10u 25V  [CAPACITOR 0805]
C74  10u 25V  [CAPACITOR 0805]
C75  100n 100V  [CAPACITOR 0805]
C76  10u 25V  [CAPACITOR 0805]
C77  100n 100V  [CAPACITOR 0805]
J6  USB4105  [MECHANICAL USB USB4105]
L2  150mΩ  [FERRITE 0805]
L3  150mΩ  [FERRITE 0805]
L4  2700R  [FERRITE 0805]
L5  2700R  [FERRITE 0805]
L6  2700R  [FERRITE 0805]
L7  2700R  [FERRITE 0805]
R69  33R  [RESISTOR 0805]
R70  33R  [RESISTOR 0805]
R71  4.7k  [RESISTOR 0805]
R72  4.7k  [RESISTOR 0805]
TP69  1mm  [TEST POINT 1MM]  (value not drawn)
TP70  1mm  [TEST POINT 1MM]  (value not drawn)
TP71  1mm  [TEST POINT 1MM]  (value not drawn)
TP72  1mm  [TEST POINT 1MM]  (value not drawn)
TP73  1mm  [TEST POINT 1MM]  (value not drawn)
TP74  1mm  [TEST POINT 1MM]  (value not drawn)

### Ports
USB (harness USB, see TOP[2B], MCU[4D])

### Nets
+5V: C72.2 C73.2 L2.1 L3.1
DGND: C72.1 C73.1 C74.1 C75.1 C76.1 C77.1 J6.1(GND) J6.12(GND) L4.1 L5.1 L6.1 L7.1 R71.1 R72.1
USB.D_N: R70.2 TP73.1
USB.D_P: R69.2 TP71.1
NetC74_2: C74.2 C75.2 J6.11(VBUS) L3.2 TP72.1
NetC76_2: C76.2 C77.2 J6.2(VBUS) L2.2 TP70.1
NetJ6_4: J6.4(CC1) R72.2
NetJ6_5: J6.5(D-) J6.7(D-) R70.1 TP74.1
NetJ6_6: J6.6(D+) J6.8(D+) R69.1 TP69.1
NetJ6_10: J6.10(CC2) R71.2
NetJ6_S1: J6.S1(SH1) L4.2
NetJ6_S2: J6.S2(SH2) L5.2
NetJ6_S3: J6.S3(SH3) L6.2
NetJ6_S4: J6.S4(SH4) L7.2

Not connected (* = marked no-connect by the designer): J6 3(SBU2)* 9(SBU1)*

### Buses and harness runs
harness USB = port USB

### Layout directives
differential pair; Parameter 1: USB: USB.D_N, USB.D_P

### Notes on the sheet
- (in symbol Mechanical USB-C Right Angle MUSBRM1C130) USB-C

### Library data of the parts
C72 C75 C77 = Capacitor 100n 100V 10% X7R 0805: as C5 on sheet INPUT; ComponentLink1Description: Datasheet; ComponentLink1URL: https://www.tme.eu/Document/fbb9415081fcefba62c0f8bbf5b21210/UPY-GPHC_X7R_6.3V-to-50V_20.pdf; Footprint: Capacitor 0805; Price 10pcs [$]: 0.0770; Supplier: TME
C73 C74 C76 = Capacitor 10u 25V 10% X5R 0805: as C2 on sheet INPUT; ComponentLink1Description: Datasheet; ComponentLink1URL: https://www.tme.eu/Document/58bb7db4269ac3ad53d1aa3c0ade9bab/GRM.pdf; Footprint: Capacitor 0805; Price 10pcs [$]: 0.0784; Supplier: TME
J6 = Mechanical USB-C Right Angle MUSBRM1C130: Socket; USB C; SMT; PIN: 16; horizontal; top board mount; USB 2.0; Manufacturer: GCT; Manufacturer Part Number: USB4105-GF-A; ComponentLink1Description: Datasheet; ComponentLink1URL: https://gct.co/Files/Drawings/USB4105.pdf?v=dfccde62-75d7-4236-8ef4-6cd7ea57494a; Price 10pcs [$]: 0.865; Supplier: TME
L2 L3 = Inductor Ferrite Bead 150mΩ 0805 1A: Inductor: ferrite; SMD; 0805; 2.2uH; 1A; 150mΩ; 2MHz; ±20%; -40÷125°C; Manufacturer: TDK; Manufacturer Part Number: MLP2012H2R2MT0S1; ComponentLink1Description: Datasheet; ComponentLink1URL: https://www.tme.eu/Document/ba697dde332dbf0a0abfb0dda9326bd0/mlp2012.pdf; Price 10pcs [$]: 0.23; Supplier: TME
L4-L7 = Inductor Ferrite Bead 2700Ω 0805 0.2A: as L1 on sheet MCU; ComponentLink1Description: Datasheet; ComponentLink1URL: https://www.tme.eu/Document/c9c44cce174b2958868ee1fe8b54450c/BLM21B222SPT-DTE.pdf; Price 10pcs [$]: 0.11; Supplier: TME
R69 R70 = Resistor 33R 1% 1/8W 0805: as R2 on sheet INPUT; ComponentLink1Description: Datasheet; ComponentLink1URL: https://www.tme.eu/Document/7b8fed8c112f8a94930279c22c957f7f/rc0805yageo.pdf; Footprint: Resistor 0805; Price 10pcs [$]: 0.023; Supplier: TME
R71 R72 = Resistor 4.7k 1% 1/8W 0805: as R18 on sheet OUTPUT; ComponentLink1Description: Datasheet; ComponentLink1URL: https://www.tme.eu/Document/7b8fed8c112f8a94930279c22c957f7f/rc0805yageo.pdf; Price 10pcs [$]: 0.02250; Supplier: TME
TP69-TP74 = Mechanical Test Point 1mm: Tesp Point 1mm; ComponentLink1Description: Datasheet; ComponentLink1URL: -; Manufacturer: -; Manufacturer Part Number: -; Footprint: -; Price 10pcs [$]: -; Supplier: -